# EAGLE design Adafruit MEMENTO Camera Board (EAGLE 9.6.2)

## Sheet 1 of 2
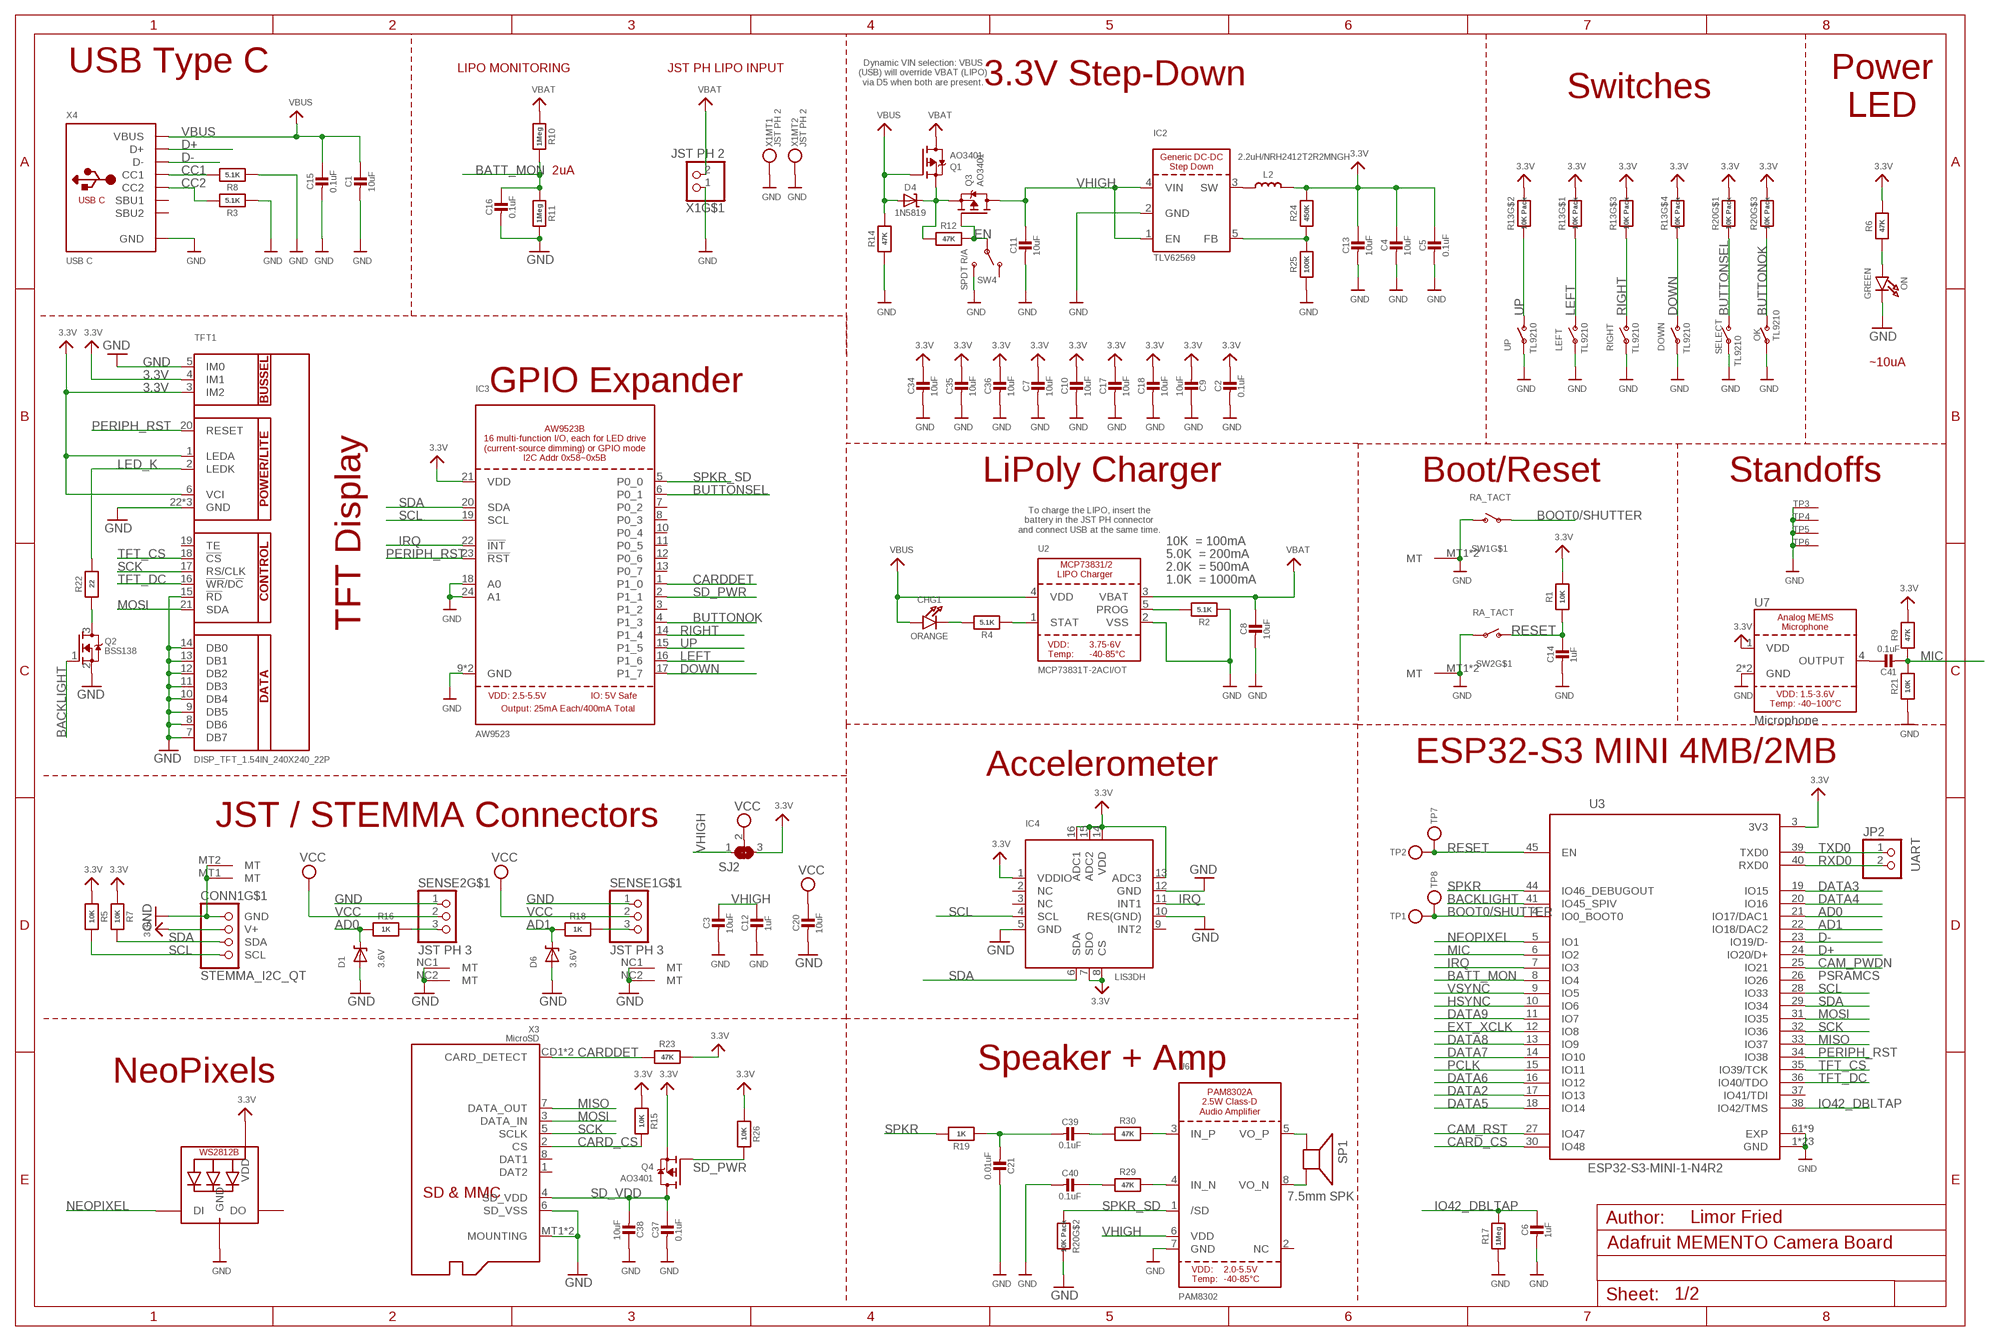
[diagram p0: schematic, sheet 1]

### Parts
C1  10uF  CAP_CERAMIC0805-NOOUTLINE  [0805-NO]
C2  0.1uF  CAP_CERAMIC0603_NO  [0603-NO]
C3  10uF  CAP_CERAMIC0805-NOOUTLINE  [0805-NO]
C4  10uF  CAP_CERAMIC0805-NOOUTLINE  [0805-NO]
C5  0.1uF  CAP_CERAMIC0603_NO  [0603-NO]
C6  1uF  CAP_CERAMIC0603_NO  [0603-NO]
C7  10uF  CAP_CERAMIC0805-NOOUTLINE  [0805-NO]
C8  10uF  CAP_CERAMIC0805-NOOUTLINE  [0805-NO]
C9  10uF  CAP_CERAMIC0805-NOOUTLINE  [0805-NO]
C10  10uF  CAP_CERAMIC0805-NOOUTLINE  [0805-NO]
C11  10uF  CAP_CERAMIC0805-NOOUTLINE  [0805-NO]
C12  1uF  CAP_CERAMIC0603_NO  [0603-NO]
C13  10uF  CAP_CERAMIC0805-NOOUTLINE  [0805-NO]
C14  1uF  CAP_CERAMIC0603_NO  [0603-NO]
C15  0.1uF  CAP_CERAMIC0603_NO  [0603-NO]
C16  0.1uF  CAP_CERAMIC0603_NO  [0603-NO]
C17  10uF  CAP_CERAMIC0805-NOOUTLINE  [0805-NO]
C18  10uF  CAP_CERAMIC0805-NOOUTLINE  [0805-NO]
C20  10uF  CAP_CERAMIC0805-NOOUTLINE  [0805-NO]
C21  0.01uF  CAP_CERAMIC0603_NO  [0603-NO]
C34  10uF  CAP_CERAMIC0805-NOOUTLINE  [0805-NO]
C35  10uF  CAP_CERAMIC0805-NOOUTLINE  [0805-NO]
C36  10uF  CAP_CERAMIC0805-NOOUTLINE  [0805-NO]
C37  0.1uF  CAP_CERAMIC0603_NO  [0603-NO]
C38  10uF  CAP_CERAMIC0805-NOOUTLINE  [0805-NO]
C39  0.1uF  CAP_CERAMIC0603_NO  [0603-NO]
C40  0.1uF  CAP_CERAMIC0603_NO  [0603-NO]
C41  0.1uF  CAP_CERAMIC0603_NO  [0603-NO]
CHG1  ORANGE  LED0603_NOOUTLINE  [CHIPLED_0603_NOOUTLINE]
CONN1  STEMMA_I2C_QT  [JST_SH4]
D1  3.6V  DIODE-ZENERSOD323  [SOD-323]
D4  1N5819  DIODE-SCHOTTKYSOD-123  [SOD-123]
D6  3.6V  DIODE-ZENERSOD323  [SOD-323]
DOWN  TL9210  SWITCH_SPST_NOMNT_TL9210  [TL9210]
IC2  TLV62569  VREG_BUCK_5PIN_AP3429/A  [SOT23-5]
IC3  AW9523  [QFN24_4MM_SMSC]
IC4  LIS3DH  ACCEL_LIS3DHTR  [LGA16_3X3MM]
JP2  UART  HEADER-1X2ROUND  [1X02_ROUND]
L2  2.2uH/NRH2412T2R2MNGH  INDUCTORNR3015  [INDUCTOR_TAIYOYUDEN_NR3015]
LED2  WS2812B_SK6805_1515  [SK6805_1515]
LEFT  TL9210  SWITCH_SPST_NOMNT_TL9210  [TL9210]
OK  TL9210  SWITCH_SPST_NOMNT_TL9210  [TL9210]
ON  GREEN  LED0603_NOOUTLINE  [CHIPLED_0603_NOOUTLINE]
Q1  AO3401  MOSFET-P  [SOT23-R]
Q2  BSS138  MOSFET-NWIDE  [SOT23-WIDE]
Q3  AO3401  MOSFET-P  [SOT23-R]
Q4  AO3401  MOSFET-P  [SOT23-R]
R1  10K  RESISTOR_0603_NOOUT  [0603-NO]
R2  5.1K  RESISTOR_0603_NOOUT  [0603-NO]
R3  5.1K  RESISTOR_0603_NOOUT  [0603-NO]
R4  5.1K  RESISTOR_0603_NOOUT  [0603-NO]
R5  10K  RESISTOR_0603_NOOUT  [0603-NO]
R6  47K  RESISTOR_0603_NOOUT  [0603-NO]
R7  10K  RESISTOR_0603_NOOUT  [0603-NO]
R8  5.1K  RESISTOR_0603_NOOUT  [0603-NO]
R9  47K  RESISTOR_0603_NOOUT  [0603-NO]
R10  1Meg  RESISTOR_0603_NOOUT  [0603-NO]
R11  1Meg  RESISTOR_0603_NOOUT  [0603-NO]
R12  47K  RESISTOR_0603_NOOUT  [0603-NO]
R13  10K Pack  RESISTOR_4PACK  [RESPACK_4X0603]
R14  47K  RESISTOR_0603_NOOUT  [0603-NO]
R15  10K  RESISTOR_0603_NOOUT  [0603-NO]
R16  1K  RESISTOR_0603_NOOUT  [0603-NO]
R17  1Meg  RESISTOR_0603_NOOUT  [0603-NO]
R18  1K  RESISTOR_0603_NOOUT  [0603-NO]
R19  1K  RESISTOR_0603_NOOUT  [0603-NO]
R20  10K Pack  RESISTOR_4PACK  [RESPACK_4X0603]
R21  10K  RESISTOR_0603_NOOUT  [0603-NO]
R22  22  RESISTOR_0603_NOOUT  [0603-NO]
R23  47K  RESISTOR_0603_NOOUT  [0603-NO]
R24  450K  RESISTOR_0603_NOOUT  [0603-NO]
R25  100K  RESISTOR_0603_NOOUT  [0603-NO]
R26  10K  RESISTOR_0603_NOOUT  [0603-NO]
R29  47K  RESISTOR_0603_NOOUT  [0603-NO]
R30  47K  RESISTOR_0603_NOOUT  [0603-NO]
RIGHT  TL9210  SWITCH_SPST_NOMNT_TL9210  [TL9210]
SELECT  TL9210  SWITCH_SPST_NOMNT_TL9210  [TL9210]
SENSE1  JST PH 3  CON_JST_PH_3PIN  [JSTPH3]
SENSE2  JST PH 3  CON_JST_PH_3PIN  [JSTPH3]
SJ2  SOLDERJUMPER_2WAY  [SOLDERJUMPER_2WAY_OPEN_NOPASTE]
SP1  7.5mm SPK  SPEAKER_7.5MM  [BUZZER_SMT_7.5MM]
SW1  RA_TACT  SWITCH_SPST_MNT_TACT_RA  [SPST_TACTILE_RA]
SW2  RA_TACT  SWITCH_SPST_MNT_TACT_RA  [SPST_TACTILE_RA]
SW4  SPDT R/A  SWITCH_SPDT  [SPDT_SMT_SSSS811101]
TFT1  DISP_TFT_1.54IN_240X240_22P  [TFT_1.54IN_240X240_22PIN]
TP1  TESTPOINTROUND1.5MMNO  [TESTPOINT_ROUND_1.5MM_NO]
TP2  TESTPOINTROUND1.5MMNO  [TESTPOINT_ROUND_1.5MM_NO]
TP3  SEWTAP_SMTNUTM3  [SMT_NUT_3MM]
TP4  SEWTAP_SMTNUTM3  [SMT_NUT_3MM]
TP5  SEWTAP_SMTNUTM3  [SMT_NUT_3MM]
TP6  SEWTAP_SMTNUTM3  [SMT_NUT_3MM]
TP7  TESTPOINTROUND1.5MMNO  [TESTPOINT_ROUND_1.5MM_NO]
TP8  TESTPOINTROUND1.5MMNO  [TESTPOINT_ROUND_1.5MM_NO]
U2  MCP73831T-2ACI/OT  MCP73831/2  [SOT23-5]
U3  ESP32-S3-MINI-1-N4R2  ESP32-S3-MINI-1  [ESP32-S2-MINI-1]
U6  PAM8302  AUDIOAMP_PAM8302A  [MSOP8_0.65MM]
U7  Microphone  ANALOG_MEMS_MIC_2.75X1.85  [MEMS_MIC_2.75X1.85]
UP  TL9210  SWITCH_SPST_NOMNT_TL9210  [TL9210]
X1  JST PH 2  CON_JST_PH_2PIN_MT_BATT  [JSTPH2_BATT]
X3  MicroSD  MICROSD  [MICROSD]
X4  USB C  USB_C  [USB_C_CUSB31-CFM2AX-01-X]

### Nets
3.3V [power]: C2.1 C4.1 C5.1 C7.1 C9.2 C10.1 C13.1 C17.1 C18.1 C34.1 C35.1 C36.1 CONN1.2(V+) IC3.21(VDD) IC4.1(VDDIO) IC4.7(SDO) IC4.8(CS) IC4.13(ADC3) IC4.14(VDD) IC4.15(ADC2) IC4.16(ADC1) L2.P$2 LED2.2(VDD) Q4.2(S) R1.2 R5.1 R6.2 R7.1 R9.2 R13.5 R13.6 R13.7 R13.8 R15.2 R20.6 R20.8 R23.2 R24.2 R26.1 SJ2.3 TFT1.1(LEDA) TFT1.3(IM2) TFT1.4(IM1) TFT1.6(VCI) U3.3(3V3) U7.1(VDD) ; also sheet 2
A1_JST1: R18.1 SENSE1.3
AD0: D1.C R16.2 U3.21(IO17/DAC1)
AD1: D6.C R18.2 U3.22(IO18/DAC2)
BACKLIGHT: Q2.1(G) U3.41(IO45_SPIV)
BATT_MON: C16.1 R10.2 R11.1 U3.8(IO4)
BOOT0/SHUTTER: SW1.1(P) TP1.P$1 TP8.P$1 U3.4(IO0_BOOT0)
BUTTONOK: IC3.4(P1_3) OK.2(S) R20.3
BUTTONSEL: IC3.6(P0_1) R20.1 SELECT.2(S)
CAM_PWDN: U3.25(IO21) ; also sheet 2
CAM_RST: U3.27(IO47) ; also sheet 2
CARD_CS: R15.1 U3.30(IO48) X3.2(CS)
CARDDET: IC3.1(P1_0) R23.1 X3.CD1(CARD_DETECT) X3.CD2(CARD_DETECT)
CC1: R8.2 X4.A5(CC1)
CC2: R3.2 X4.B5(CC2)
D10_JST: R16.1 SENSE2.3
D+: U3.24(IO20/D+) X4.A6(D+) X4.B6(D+)
D-: U3.23(IO19/D-) X4.A7(D-) X4.B7(D-)
DATA2: U3.17(IO13) ; also sheet 2
DATA3: U3.19(IO15) ; also sheet 2
DATA4: U3.20(IO16) ; also sheet 2
DATA5: U3.18(IO14) ; also sheet 2
DATA6: U3.16(IO12) ; also sheet 2
DATA7: U3.14(IO10) ; also sheet 2
DATA8: U3.13(IO9) ; also sheet 2
DATA9: U3.11(IO7) ; also sheet 2
DOWN: DOWN.2(S) IC3.17(P1_7) R13.4
EN: Q3.1(G) R12.2 SW4.B(P)
EXT_XCLK: U3.12(IO8) ; also sheet 2
FB: IC2.5(FB) R24.1 R25.2
GND [lowpower]: C1.2 C2.2 C3.2 C4.2 C5.2 C6.2 C7.2 C8.2 C9.1 C10.2 C11.2 C12.2 C13.2 C14.2 C15.2 C16.2 C17.2 C18.2 C20.2 C21.1 C34.2 C35.2 C36.2 C37.2 C38.1 C40.2 CONN1.1(GND) CONN1.MT1(MT) CONN1.MT2(MT) D1.A D6.A DOWN.1(P) IC2.2(GND) IC3.9(GND) IC3.18(A0) IC3.24(A1) IC3.THERM(GND) IC4.5(GND) IC4.10(RES(GND)) IC4.12(GND) LED2.4(GND) LEFT.1(P) OK.1(P) ON.C Q2.2(S) R2.1 R3.1 R8.1 R11.2 R14.1 R17.1 R20.7 R21.1 R25.1 RIGHT.1(P) SELECT.1(P) SENSE1.1 SENSE1.NC1(MT) SENSE1.NC2(MT) SENSE2.1 SENSE2.NC1(MT) SENSE2.NC2(MT) SW1.2(S) SW1.MT1(MT) SW1.MT2(MT) SW2.1(P) SW2.MT1(MT) SW2.MT2(MT) SW4.C(S) TFT1.5(IM0) TFT1.7(DB7) TFT1.8(DB6) TFT1.9(DB5) TFT1.10(DB4) TFT1.11(DB3) TFT1.12(DB2) TFT1.13(DB1) TFT1.14(DB0) TFT1.15(!RD) TFT1.22(GND) TFT1.SUPPORT1(GND) TFT1.SUPPORT2(GND) TP3.P$1(SEW) TP4.P$1(SEW) TP5.P$1(SEW) TP6.P$1(SEW) U2.2(VSS) U3.1(GND) U3.2(GND) U3.42(GND) U3.43(GND) U3.46(GND) U3.47(GND) U3.48(GND) U3.49(GND) U3.50(GND) U3.51(GND) U3.52(GND) U3.53(GND) U3.54(GND) U3.55(GND) U3.56(GND) U3.57(GND) U3.58(GND) U3.59(GND) U3.60(GND) U3.61(EXP) U3.62(GND) U3.63(GND) U3.64(GND) U3.65(GND) U3.66(EXP) U3.67(EXP) U3.68(EXP) U3.69(EXP) U3.70(EXP) U3.71(EXP) U3.72(EXP) U3.73(EXP) U6.7(GND) U7.2(GND) U7.3(GND) UP.1(P) X1.1 X1.NC1 X1.NC2 X3.6(SD_VSS) X3.MT1(MOUNTING) X3.MT2(MOUNTING) X4.A1B12(GND) X4.B1A12(GND) ; also sheet 2
HSYNC: U3.10(IO6) ; also sheet 2
IO42_DBLTAP: C6.1 R17.2 U3.38(IO42/TMS)
IRQ: IC3.22(!INT) IC4.11(INT1) U3.7(IO3)
LED_K: R22.1 TFT1.2(LEDK)
LEFT: IC3.16(P1_6) LEFT.2(S) R13.1
MIC: C41.2 R9.1 R21.2 U3.6(IO2)
MISO: U3.33(IO37) X3.7(DATA_OUT)
MOSI: TFT1.21(SDA) U3.31(IO35) X3.3(DATA_IN)
N$1: C41.1 U7.4(OUTPUT)
N$3: ON.A R6.1
N$4: R4.1 U2.1(STAT)
N$5: Q2.3(D) R22.2
N$6: CHG1.C R4.2
N$7: R29.2 U6.4(IN_N)
N$8: R30.2 U6.3(IN_P)
N$9: R2.2 U2.5(PROG)
N$10: C40.1 R29.1
N$11: SP1.- U6.8(VO_N)
N$12: SP1.+ U6.5(VO_P)
N$13: C39.1 R30.1
N$14: C21.2 C39.2 R19.1
N$15: IC2.3(SW) L2.P$1
N$21: D4.C Q1.2(S) Q3.2(S) R12.1
NEOPIXEL: LED2.1(DI) U3.5(IO1)
PCLK: U3.15(IO11) ; also sheet 2
PERIPH_RST: IC3.23(!RST) TFT1.20(RESET) U3.34(IO38)
RESET: C14.1 R1.1 SW2.2(S) TP2.P$1 TP7.P$1 U3.45(EN)
RIGHT: IC3.14(P1_4) R13.3 RIGHT.2(S)
RXD0: JP2.2 U3.40(RXD0)
SCK: TFT1.17(RS/CLK) U3.32(IO36) X3.5(SCLK)
SCL: CONN1.4(SCL) IC3.19(SCL) IC4.4(SCL) R5.2 U3.28(IO33) ; also sheet 2
SD_PWR: IC3.2(P1_1) Q4.1(G) R26.2
SD_VDD [power]: C37.1 C38.2 Q4.3(D) X3.4(SD_VDD)
SDA: CONN1.3(SDA) IC3.20(SDA) IC4.6(SDA) R7.2 U3.29(IO34) ; also sheet 2
SPKR: R19.2 U3.44(IO46_DEBUGOUT)
SPKR_SD: IC3.5(P0_0) R20.2 U6.1(/SD)
TFT_CS: TFT1.18(!CS) U3.35(IO39/TCK)
TFT_DC: TFT1.16(!WR!/D!C) U3.36(IO40/TDO)
TXD0: JP2.1 U3.39(TXD0)
UP: IC3.15(P1_5) R13.2 UP.2(S)
VBAT [power]: C8.1 Q1.3(D) R10.1 U2.3(VBAT) X1.2
VBUS [power]: C1.1 C15.1 CHG1.A D4.A Q1.1(G) R14.2 U2.4(VDD) X4.A4B9(VBUS) X4.B4A9(VBUS)
VCC [power]: C20.1 SENSE1.2 SENSE2.2 SJ2.2
VHIGH [power]: C3.1 C11.1 C12.1 IC2.1(EN) IC2.4(VIN) Q3.3(D) SJ2.1 U6.6(VDD) ; also sheet 2
VSYNC: U3.9(IO5) ; also sheet 2
Unconnected: IC3.3(P1_2) IC3.7(P0_2) IC3.8(P0_3) IC3.10(P0_4) IC3.11(P0_5) IC3.12(P0_6) IC3.13(P0_7) IC4.2(NC) IC4.3(NC) IC4.9(INT2) LED2.3(DO) R20.4 R20.5 SW4.A(O) TFT1.19(TE) U3.26(IO26) U3.37(IO41/TDI) U6.2(NC) X3.1(DAT2) X3.8(DAT1) X4.A8(SBU1) X4.B8(SBU2)

### Notes on the sheet
- USB Type C
- LIPO MONITORING | JST PH LIPO INPUT
- Dynamic VIN selection: VBUS
  (USB) will override VBAT (LIPO)
  via D5 when both are present.
- 3.3V Step-Down
- Switches
- Power
  LED
- 2uA
- ~10uA
- GPIO Expander
- LiPoly Charger | Boot/Reset | Standoffs
- To charge the LIPO, insert the
  battery in the JST PH connector
  and connect USB at the same time.
- TFT Display
- 10K  = 100mA
- 5.0K  = 200mA
- 2.0K  = 500mA
- 1.0K  = 1000mA
- ESP32-S3 MINI 4MB/2MB
- Accelerometer
- JST / STEMMA Connectors
- PSRAMCS
- Speaker + Amp
- NeoPixels
- Limor Fried

## Sheet 2 of 2
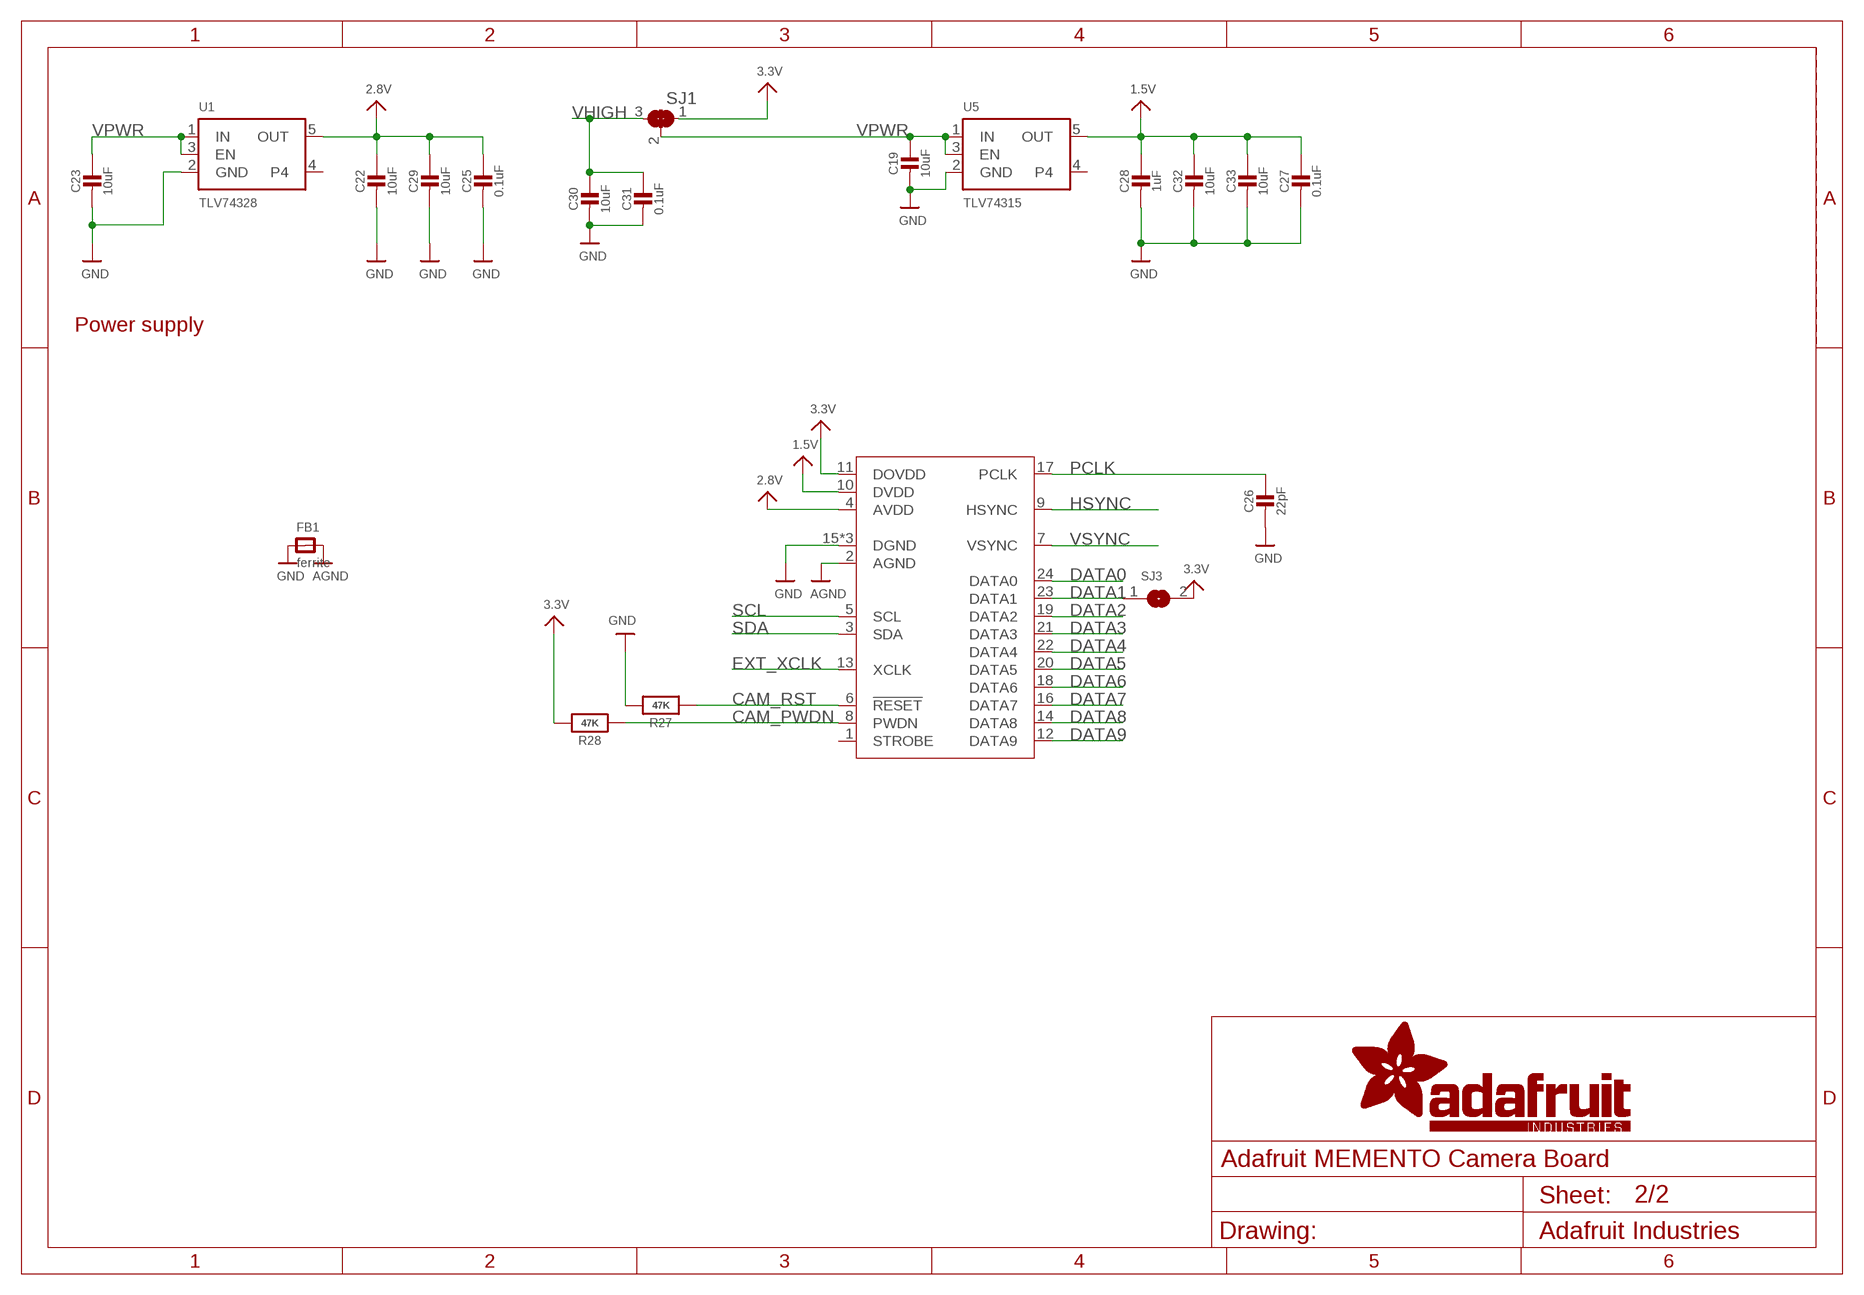
[diagram p1: schematic, sheet 2]

### Parts
C19  10uF  CAP_CERAMIC0805-NOOUTLINE  [0805-NO]
C22  10uF  CAP_CERAMIC0805-NOOUTLINE  [0805-NO]
C23  10uF  CAP_CERAMIC0805-NOOUTLINE  [0805-NO]
C25  0.1uF  CAP_CERAMIC0603_NO  [0603-NO]
C26  22pF  CAP_CERAMIC0603_NO  [0603-NO]
C27  0.1uF  CAP_CERAMIC0603_NO  [0603-NO]
C28  1uF  CAP_CERAMIC0603_NO  [0603-NO]
C29  10uF  CAP_CERAMIC0805-NOOUTLINE  [0805-NO]
C30  10uF  CAP_CERAMIC0805-NOOUTLINE  [0805-NO]
C31  0.1uF  CAP_CERAMIC0603_NO  [0603-NO]
C32  10uF  CAP_CERAMIC0805-NOOUTLINE  [0805-NO]
C33  10uF  CAP_CERAMIC0805-NOOUTLINE  [0805-NO]
FB1  ferrite  FERRITE-0603NO  [0603-NO]
R27  47K  RESISTOR_0603_NOOUT  [0603-NO]
R28  47K  RESISTOR_0603_NOOUT  [0603-NO]
SJ1  SOLDERJUMPER_2WAY  [SOLDERJUMPER_2WAY_OPEN_NOPASTE]
SJ3  SOLDERJUMPERCLOSED  [SOLDERJUMPER_CLOSEDWIRE]
U1  TLV74328  VREG_SOT23-5  [SOT23-5]
U5  TLV74315  VREG_SOT23-5  [SOT23-5]
X2  CAMERA_OV2640  [OV2640FSL]

### Nets
1.5V: C27.1 C28.1 C32.1 C33.1 U5.5(OUT) X2.10(DVDD)
2.8V [power]: C22.1 C25.1 C29.1 U1.5(OUT) X2.4(AVDD)
3.3V [power]: R28.2 SJ1.1 SJ3.2 X2.11(DOVDD) ; also sheet 1
AGND: FB1.2 X2.2(AGND)
CAM_PWDN: R28.1 X2.8(PWDN) ; also sheet 1
CAM_RST: R27.1 X2.6(!RESET) ; also sheet 1
DATA0: X2.24(DATA0)
DATA1: SJ3.1 X2.23(DATA1)
DATA2: X2.19(DATA2) ; also sheet 1
DATA3: X2.21(DATA3) ; also sheet 1
DATA4: X2.22(DATA4) ; also sheet 1
DATA5: X2.20(DATA5) ; also sheet 1
DATA6: X2.18(DATA6) ; also sheet 1
DATA7: X2.16(DATA7) ; also sheet 1
DATA8: X2.14(DATA8) ; also sheet 1
DATA9: X2.12(DATA9) ; also sheet 1
EXT_XCLK: X2.13(XCLK) ; also sheet 1
GND [lowpower]: C19.2 C22.2 C23.2 C25.2 C26.2 C27.2 C28.2 C29.2 C30.2 C31.2 C32.2 C33.2 FB1.1 R27.2 U1.2(GND) U5.2(GND) X2.15(DGND) X2.SPRT1(DGND) X2.SPRT2(DGND) ; also sheet 1
HSYNC: X2.9(HSYNC) ; also sheet 1
PCLK: C26.1 X2.17(PCLK) ; also sheet 1
SCL: X2.5(SCL) ; also sheet 1
SDA: X2.3(SDA) ; also sheet 1
VHIGH [power]: C30.1 C31.1 SJ1.3 ; also sheet 1
VPWR [power]: C19.1 C23.1 SJ1.2 U1.1(IN) U1.3(EN) U5.1(IN) U5.3(EN)
VSYNC: X2.7(VSYNC) ; also sheet 1
Unconnected: U1.4 U5.4 X2.1(STROBE)

### Notes on the sheet
- Power supply

## Library data of the parts
C1-C23 C25-C41 = microbuilder:CAP_CERAMIC: Ceramic Capacitors For new designs, use the packages preceded by an '_' character since they are more reliable: The following footprints should be used on most boards: _0402 - Standard footprint for regular board layouts _0603 - Standard footprint for regular board layouts _0805 - Standard footprint for regular board layouts _1206 - Standard footprint for regular board layouts For extremely tight-pitch boards where space is at a premium, the following 'micro-pitch' footprints can be used (smaller pads, no silkscreen outline, etc.): _0402MP - Micro-pitch footprint for very dense/compact boards _0603MP - Micro-pitch footprint for very dense/compact boards _0805MP - Micro-pitch footprint for very dense/compact boards _1206MP - Micro-pitch footprint for very dense/compact boards
CHG1 ON = microbuilder:LED: LED 0603 - 0603 Surface Mount Package 2mA: Green LED - Low Power (3.9mcd, 2ma, 1.7Vf) - Digikey: 475-2709-2-ND Orange LED - Low Power (9.8mcd, 2ma, 1.8Vf) - Digikey: 475-1194-2-ND Red LED - Low Power (5mcd, 2ma, 1.8Vf) - Digikey: 475-1195-2-ND Yellow LED - Low Power (7mcd, 2ma, 1.8Vf) - Digikey: 475-1196-2-ND 5mA: Blue LED - Low Power (17mcd, 5ma, 2.9Vf) - Digikey: LNJ937W8CRACT-ND 0805 - 0805 Surface Mount Package 2mA: Red LED (8.8mcd, 2mA, 1.8Vf, Clear) - Low Power [Digikey: 475-2510-1-ND] Green LED (5mcd, 2mA, 1.8Vf, Clear) - Low Power [Digikey: 475-2730-1-ND] Yellow LED (11.3mcd, 2mA, 1.8Vf, Clear) - Low Power [Digikey: 475-2555-1-ND] 20mA: Red LED (104mcd, 20mA, Diffused) - LS R976 [Digikey: 475-1278-6-ND] Red LED (12mcd, 20mA, 2.0Vf, Clear) - APT2012EC [Digikey: 754-1128-1-ND] Green LED (15mcd, 20mA, 2.2Vf, Clear) - APT2012GC [Digikey: 754-1131-1-ND] Orange LED (160mcd, 20mA, 2.1Vf, Clear) - APT2012SECK [Digikey: 754-1130-1-ND] 1206 - 1206 Surface Mount Package Green LED (26mcd, 20mA, Diffused) - LG N971 [Digikey: 475-1407-6-ND] Red LED (15mcd, 20mA, Diffused) - LH N974 [Digikey: 475-1416-6-ND] Cree - Cree High-Power Surface Mount LEDs XPEBWT-L1-0000-00D50 - White 111lm 350mA 2.9Vf 6200K 110° XTEAWT-00-0000-00000LEE3 - White 114lm 350mA 2.85Vf 5000K 115° Everlight - Everlight 45-21 Series Surface Mount LEDs 45-21/QK2C-B2832AC2CB2/2T - Warm White 2000mcd 20mA 3.25Vf 3050K 120° 45-21/LK2C-B38452C4CB2/2T - Nuetral White 2000mcd 20mA 3.25Vf 4150K 120° 45-21/LK2C-B50634C6CB2/2T - Cold White 2200mcd 20mA 3.25Vf 5650K 120° PLCC2 Reverse Mount LS T77K-J1L2-1-0-2-R18-Z - Red 11.25mcd 2mA 1.8Vf 630nm 120° LO T77K-L1M2-24-Z - Orange 19.6mcd 2mA 1.8Vf 606nm 120° LY T77K-K2M1-26-Z - Yellow 15.7mcd 2mA 1.8Vf 587nm 120°; ROT: 270
CONN1 = adafruit_electromech:STEMMA_I2C; LCSC: C2845363
D1 D6 = microbuilder:DIODE-ZENER: Zener Diode SMA: 30V 1W Zener Diode, 1.2Vf - Digikey: SMAZ30-FDICT-ND
D4 = microbuilder:DIODE-SCHOTTKY
DOWN LEFT OK RIGHT SELECT UP = adafruit_electromech:SWITCH_SPST_NOMNT
FB1 = microbuilder:FERRITE: Ferrite Bead 0603 MMZ1608B121C - 120 Ohm @ 100MHz, 600mA, 0.15 Ohm DC Resistance - Digikey: 445-2164-1-ND BK1608HW121-T - 120 Ohm, 600mA Ferrite Chip - Digikey: 587-1876-2-ND 0805 HZ0805B272R-10 - 2.7K Ohm @ 100MHz, 200mA, 0.8 Ohm DC Resistance - Digikey: 240-2504-1-ND (see also Murata BLM21BD272SN1L) MMZ2012Y152B - 1.5K Ohm @ 100MHz, 500mA, 0.4 Ohm DC Resistance - Digikey: 445-1560-1-ND - Mainly for high frequency (80-400MHz) MMZ2012R102A - 1K Ohm @ 100MHz, 500mA, 0.3 Ohm DC Resistance - Digikey: 445-1555-2-ND - More general purpose (10-200MHz)
IC2 = adafruit_power:VREG_BUCK_5PIN
IC3 = microbuilder:AW9523
IC4 = adafruit_sensor:ACCEL_LIS3DHTR: LIS3DHTR 3-Axis Accelerometer with I2C/SPI Interface VDD: 1.71-3.6V VDDIO: 1.71-VDD+0.1V Scale: +/-2g, 4g, 8g, 16g with 16--bit data output Temp:: -40°C - 85°C Mouser: 511-LIS3DHTR Digikey: 497-10613-1-ND
JP2 = microbuilder:HEADER-1X2: PIN HEADER
L2 = microbuilder:INDUCTOR: Inductors 0603: 10nH Ceramic Inductor - microwire antenna/RF (Digikey: 712-1434-2-ND) 0805: 560nH Ceramic Inductor - RF (Digikey: 553-1047-1-ND) 270nH Ceramic Inductor - Q = 40@250MHz, +-5%, 1 Ohm DC Resistance (Digikey: 535-10506-2-ND) 1007 (2518 Metric) SMT: 10µH 10% 250mOhm 820mA 1007 Inductor (Digikey: 587-2189-1-ND) 22µH 10% 500mOhm 580mA 1007 Inductor (Digikey: 587-2190-1-ND) 47µH 10% 950mOhm 420mA 1007 Inductor (Digikey: 587-2191-1-ND) 47µH 5% 100mOhm 1A 1008 Inductor (Digikey: 732-1816-1-ND) 5.0x5.0mm (Taiyo Yuden NR5040 Series) 6.8µH 20% 2.3A 64mOhm Inductor (Digikey: 587-2374-2-ND) 5.0x5.0mm (TDK VLC5045 Series) 4.7µH 20% 3.3A 34mOhm Inductor (Digikey: 445-6526-1-ND) 6.8µH 20% 2.7A 46mOhm Inductor (Digikey: 445-6527-1-ND) 6.0x6.0mm (TDK VLC6045 Series) 4.7µH 20% 3.8A 27mOhm Inductor (Digikey: 445-6538-2-ND) 6.8µH 20% 3A 41mOhm Inductor (Digikey: 445-6540-1-ND) 6.2µH 30% 2.2A 45mOhm Inductor (Digikey: SRR5028-6R2YCT-ND) - Not TDK VLC6045 but footprint should match 6.0x6.0mm (TDK SLF6045 Series) 6.8uH 30% 2A 33mOhm Inductor (Digikey: 445-4572-1-ND, Mouser: 810-SLF645T6R8N2R0PF) 6.0x6.0mm (Sumida CDRH5D28 Series) 6.2uH 30% 1.8A 45mOhm Inductor (Digikey: 308-1542-1-ND) Taiyo Yuden NR3015T2R2M - 2.2uH 20% 1.5A (Digikey: 587-1648-2-ND, Mouser: 963-NR3015T2R2M) - Used with TI TPS62172 CoilCraft RFID Transponder Coil - MA5532-AE (For use with AS3935 Lightning Sensor) Taiyo Yuden NRH2412T2R2MNGH - 2.2uH 20% 1AA (Digikey: 587-3443-1-ND) - Used with TI LM3671 Vishay IHLP 1.0uH Molded Inductor - 24mOhm DCR, 5A, +/-20%, -55°C-125°C (Digikey: 541-1319-1-ND)
LED2 = microbuilder:WS2812B; LCSC: C2890035
Q1 Q3 Q4 = microbuilder:MOSFET-P: P-Channel Mosfet LEGEND VDS: Voltage Drain-Source ID: Drain Current RDS(ON): Drain-Source On-State Resistance VGS(TH): Gate-Source Threshold Voltage CISS: Drain-Source Input Capacitance SOT-23 Name VDS ID RDS(ON) VGS(TH) CISS Order Number IRLML5103 30V 760mA 600 mOhm -- 75pF @ 25V Digikey: IRLML5103PBFCT-ND IRLML6401 12V 4.3A 50 mOhm 950mV @ 250µA 830pF @ 10V Digikey: IRLML6401PBFTR-ND NTR0202PL 20V 400mA 800 mOhm 2.3V @ 250uA 70pF @ 5V Digikey: NTR0202PLT1GOSTR-ND NTR4101PT1G 20V 1.8A 85 mOhm 1.2V @ 250uA 675pF @ 10V Digikey: NTR4101PT1GOSCT-ND DMP2004K 20V 600mA 900 mOhm 1V @ 250uA 175pF @ 16V Digikey: DMP2004KDICT-ND PMV65XP 20V 3.9A 76 mOhm 950mV @ 1mA 725pF @ 20V Digikey: 568-2358-2-ND TO-252 Name VDS ID RDS(ON) VGS(TH) CISS Order Number AOD417 30V 25A 34 mOhm 3V @ 250µA 920pF @ 15V Digikey: 785-1106-2-ND PowerPak Name VDS ID RDS(ON) VGS(TH) CISS Order Number AON7401 30V 12A 14 mOhm 3V @ 250µA 2600pF @ 15V Digikey: 785-1302-1-ND
Q2 = microbuilder:MOSFET-N: N-Channel Mosfet LEGEND VDS: Voltage Drain-Source ID: Drain Current RDS(ON): Drain-Source On-State Resistance VGS(TH): Gate-Source Threshold Voltage CISS: Drain-Source Input Capacitance SOT-23 Name VDS ID RDS(ON) VGS(TH) CISS Order Number 2N7002E 60V 260mA 2.5 Ohm 2.5V @ 250uA 26.7pF @ 25V 2N7002ET1GOSTR-ND BSH103 30V 850mA 400 mOhm 400mV @ 1mA 83pF @ 24V BSH103,235-ND BSS138 60V 320mA 1.6 Ohm 1.5V @ 250uA 50pF @ 10V Mouser: 771-BSS138PW115 DMN2075U-7 20V 4.2A 38 mOhm 1V @ 250 uA 594.3pF @ 10V DMN2075U-7DICT-ND * BSS138 good choice for I2C level-shifting POWERPAK 1212-8 Name VDS ID RDS(ON) VGS(TH) CISS Order Number Si7308DN 60V 6A 58 mOhm 3V @ 250uA 665pF @ 15V SI7308DN-T1-E3CT-ND
R1-R12 R14-R19 R21-R30 = microbuilder:RESISTOR: Resistors For new designs, use the packages preceded by an '_' character since they are more reliable: The following footprints should be used on most boards: _0402 - Standard footprint for regular board layouts _0603 - Standard footprint for regular board layouts _0805 - Standard footprint for regular board layouts _1206 - Standard footprint for regular board layouts For extremely tight-pitch boards where space is at a premium, the following 'micro-pitch' footprints can be used (smaller pads, no silkscreen outline, etc.): _0402MP - Micro-pitch footprint for very dense/compact boards _0603MP - Micro-pitch footprint for very dense/compact boards _0805MP - Micro-pitch footprint for very dense/compact boards _1206MP - Micro-pitch footprint for very dense/compact boards
R13 R20 = microbuilder:RESISTOR_4PACK: Resistor Packs (4 resistors) 4 x 0603 10K 1/16W - Digikey: YC164J-10KCT-ND
SENSE1 SENSE2 = adafruit_electromech:CON_JST_PH_3PIN
SJ1 SJ2 = microbuilder:SOLDERJUMPER_2WAY: 2-Way Solder Jumper
SJ3 = microbuilder:SOLDERJUMPER: SMD Solder JUMPER Solder the two pads together to create a connection, or remove the solder to break it. REFLOW - Use this footprint for solder paste and reflow ovens. WAVE - Use this footprint for hand-soldering (larger pads). CLOSED - Has a trace between the two pads to ensure it is closed by default. The trace needs to be cut to disable the jumper, and can be closed again by creating a solder bridge between the two pads.
SP1 = microbuilder:SPEAKER: SPEAKER Source: Buerklin Added PS12 (for part # PS1240 piezo) http://www.ladyada.net/library/pcb/eaglelibrary.html; ROT: 180
SW1 SW2 = adafruit_electromech:SWITCH_SPST_MNT: Switch - SPST 4UCon 19192 (6.7x2.6mm SMT); LCSC: C778159
SW4 = adafruit_electromech:SWITCH_SPDT: Switch - SPDT SSSS811101 - Horizontal Two Position SMT, 0.3A 4V [Mouser: 688-SSSS811101]
TFT1 = adafruit_display:DISP_TFT_1.54IN_240X240_22P
TP1 TP2 TP7 TP8 = microbuilder:TESTPOINT: Test Point Various test points for characterisation and PCB testing TESTPOINT_SMT - Compact Surface Mount Test Point [Digikey: 5016KTR-ND]
TP3-TP6 = adafruit_electromech:SEWTAP; FORCETHM: 1
U1 U5 = adafruit_power:VREG_SOT23-5: SOT23-5 Fixed Voltage Regulators Part Current Out V Out V In V Dropout θJA (°C/W) TJ (°C) Digikey Part No. ADP121 150mA 3.3V 3.4-5.5V 0.09V @ 150mA -- -- ADP121-AUJZ33R7CT-ND ADP121 150mA 3.0V 3.1-5.5V 0.09V @ 150mA -- -- ADP121-AUJZ30R7CT-ND ADP122 300mA 3.3V 3.4-5.5V 0.085V @ 300mA -- -- ADP122AUJZ-3.3-R7CT-ND ADP1712 300mA 3.3V 3.5-5.5V 0.17V @ 300mA -- -- ADP1712AUJZ-3.3-R7TR-ND AP7311 (Low Cost) 150mA 3.3V 3.5-6V 0.15V @ 150mA -- -- AP7311-33WG-7DICT-ND LD39015M18R 150mA 1.8V 1.9V-5.5V 0.08V @ 100mA -- -- 497-6977-1-ND LP2985A-33DBVR 150mA 3.3V 3.3-16V 0.28V @ 150mA 206 150 296-18479-1-ND MCP1824T-3302E/OT 300mA 3.3V 3.5V-6V 0.2V @ 300mA -- -- MCP1824T-3302E/OTCT-ND MIC5205-2.5YM5 TR 150mA 2.5V 2.7-16V 0.165V @ 150mA -- -- 576-1257-2-ND MIC5205-3.0YM5 TR 150mA 3.0V 3.2V-16V 0.165V @ 150mA -- -- 576-1258-2-ND MIC5205-3.3YM5 TR 150mA 3.3V 3.5V-16V 0.165V @ 150mA -- -- 576-1259-2-ND TPS780330220 150mA 3.3V+2.2V 3.6-5.5V 250mV Max -- -- 296-23332-1-ND TDA3663/N1,135 100mA 3.3V 3.5-45V 0.18V @ 50mA -- -- 568-5343-1-ND Max operating temp can be calculated using θJA, TJ (max junction temperature), and power in watts. Set the "Maximum Ambient Temperature" until it reaches TJ ("Max Junction Temperature"), which is the absolute limit for safe use of the regulator: Heat Sink Temperature Calculator <http://www.daycounter.com/Calculators/Heat-Sink-Temperature-Calculator.phtml> For example, With 12V source into a 3.3V LP2985 and a 30mA load, we are dissipating (12V-3.3V) * 0.03A = 0.261W. With a θJA of 206 °C/W, a TJ of 150°C, and 261mW we can safely use the chip without a heat sink up to 75°C (=147.1°C Junction Temperature).; JLC_ROTATION: 0
U2 = microbuilder:MCP73831/2: MCP73831/2 LIPO Charger VDD: 3.75 - 6V Temp -40 - 85°C Programmable Charge Rate: 15-500mA NOTE: STAT is a tri-state logic output on the MCP73831 and an open-drain output on the MCP73832. SOT23-5 with 4.2V output and tri-state logic on STAT = MCP73831T-2ACI/OT; JLC_ROTATION: 0; LCSC: C424093
U3 = adafruit_wireless:ESP32-S3-MINI-1; BUILT_BY: EMA_Kyle; COPYRIGHT: Copyright (C) 2018 Accelerated Designs. All rights reserved; DATASHEET: https://www.espressif.com/sites/default/files/documentation/esp32-s2-mini-1_esp32-s2-mini-1u_datasheet_en.pdf; MANUFACTURER_PART_NUMBER: ESP32-S2-MINI-1; SOURCELIBRARY: Add_to_database_2020-11-03; VENDOR: Espressif Systems
U6 = microbuilder:AUDIOAMP_PAM8302A: PAM8302A - 2.5W Class-D Mono Audio Amplifier MSOP8 = PAM8302AASCR
U7 = adafruit_sensor:ANALOG_MEMS_MIC: SPW2430HR5H-B - Silicon Microphone
X1 = adafruit_electromech:CON_JST_PH_2PIN_MT; LCSC: C47647
X2 = adafruit_sensor:CAMERA_OV2640
X3 = adafruit_electromech:MICROSD: MicroSD/Transflash Card Holder with SPI pinout 3M: 2908-05WB-MG 4UConnector: 19656 Footprint courtesy: Adafruit Industries; JLC_ROTATION: 90; LCSC: C125617
X4 = adafruit_electromech:USB_C: USB Type-C USB 2.0 Connector; LCSC: C165948

## Net classes
1 power: width 0.254 mm
2 lowpower: width 0.305 mm, drill 0.483 mm

## Board
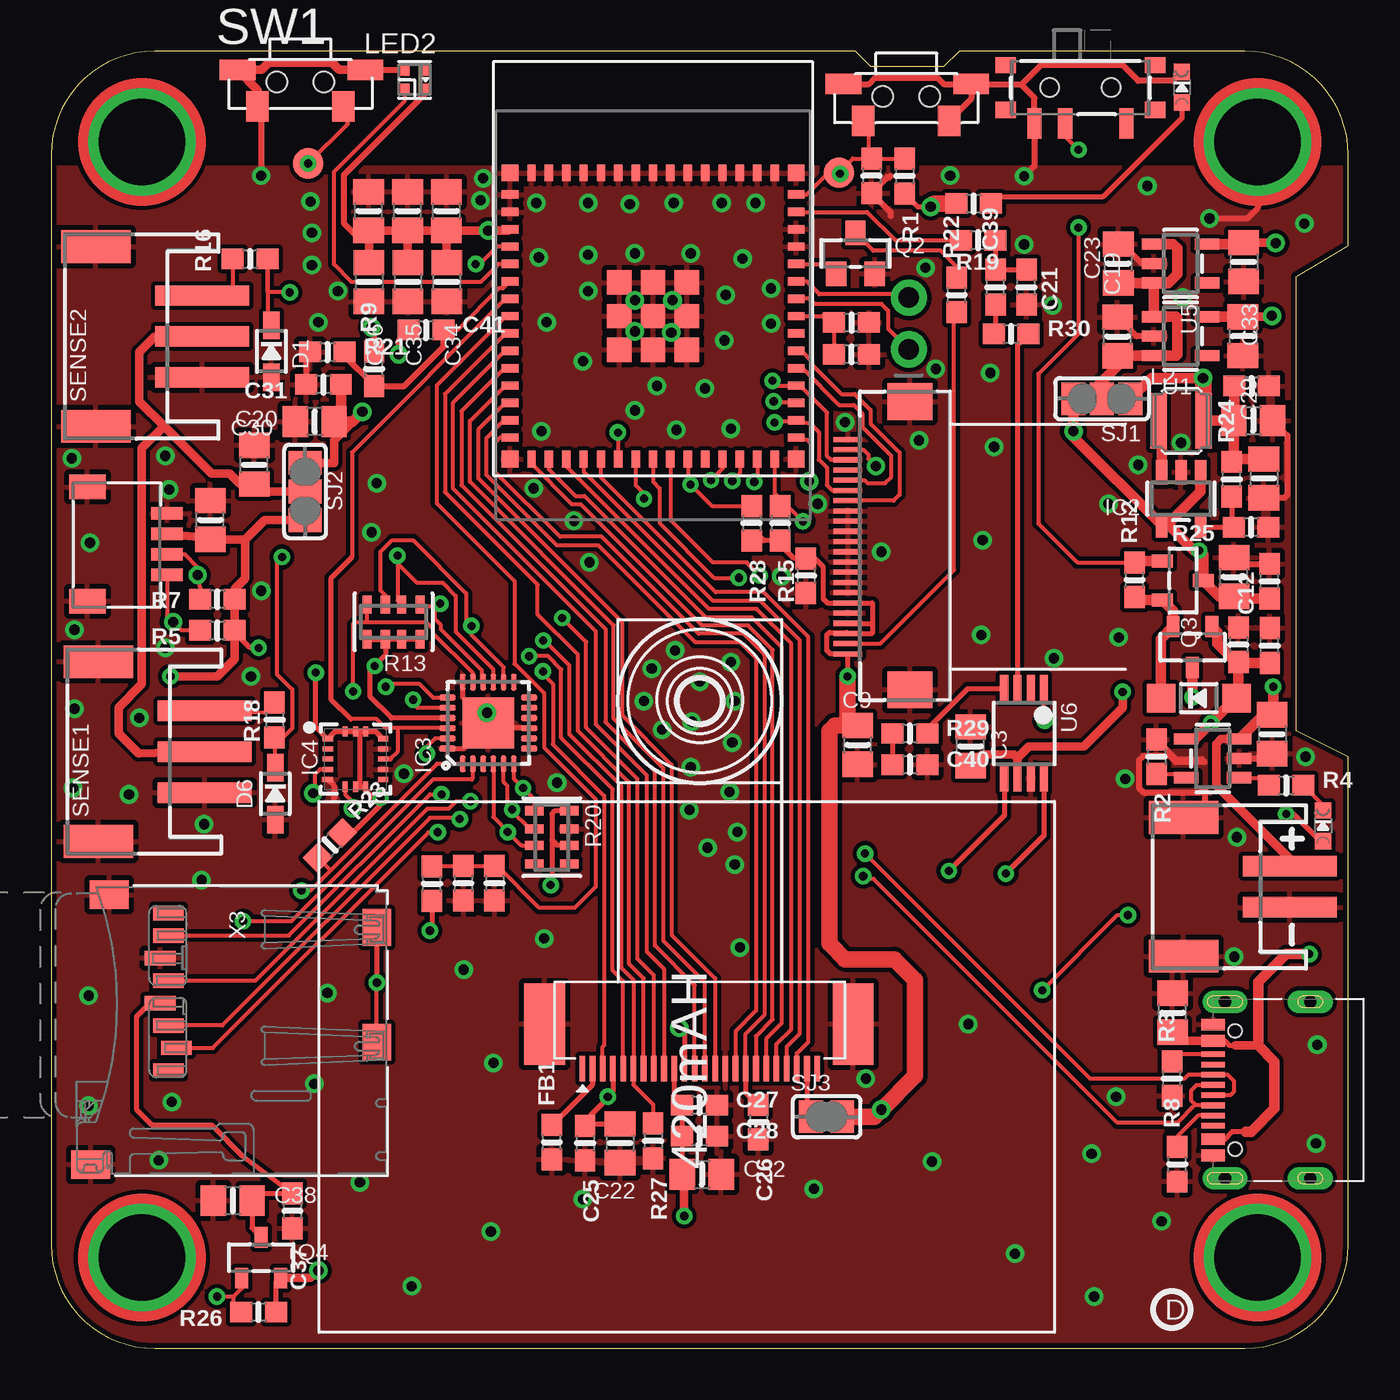
[diagram p2: board, top side]
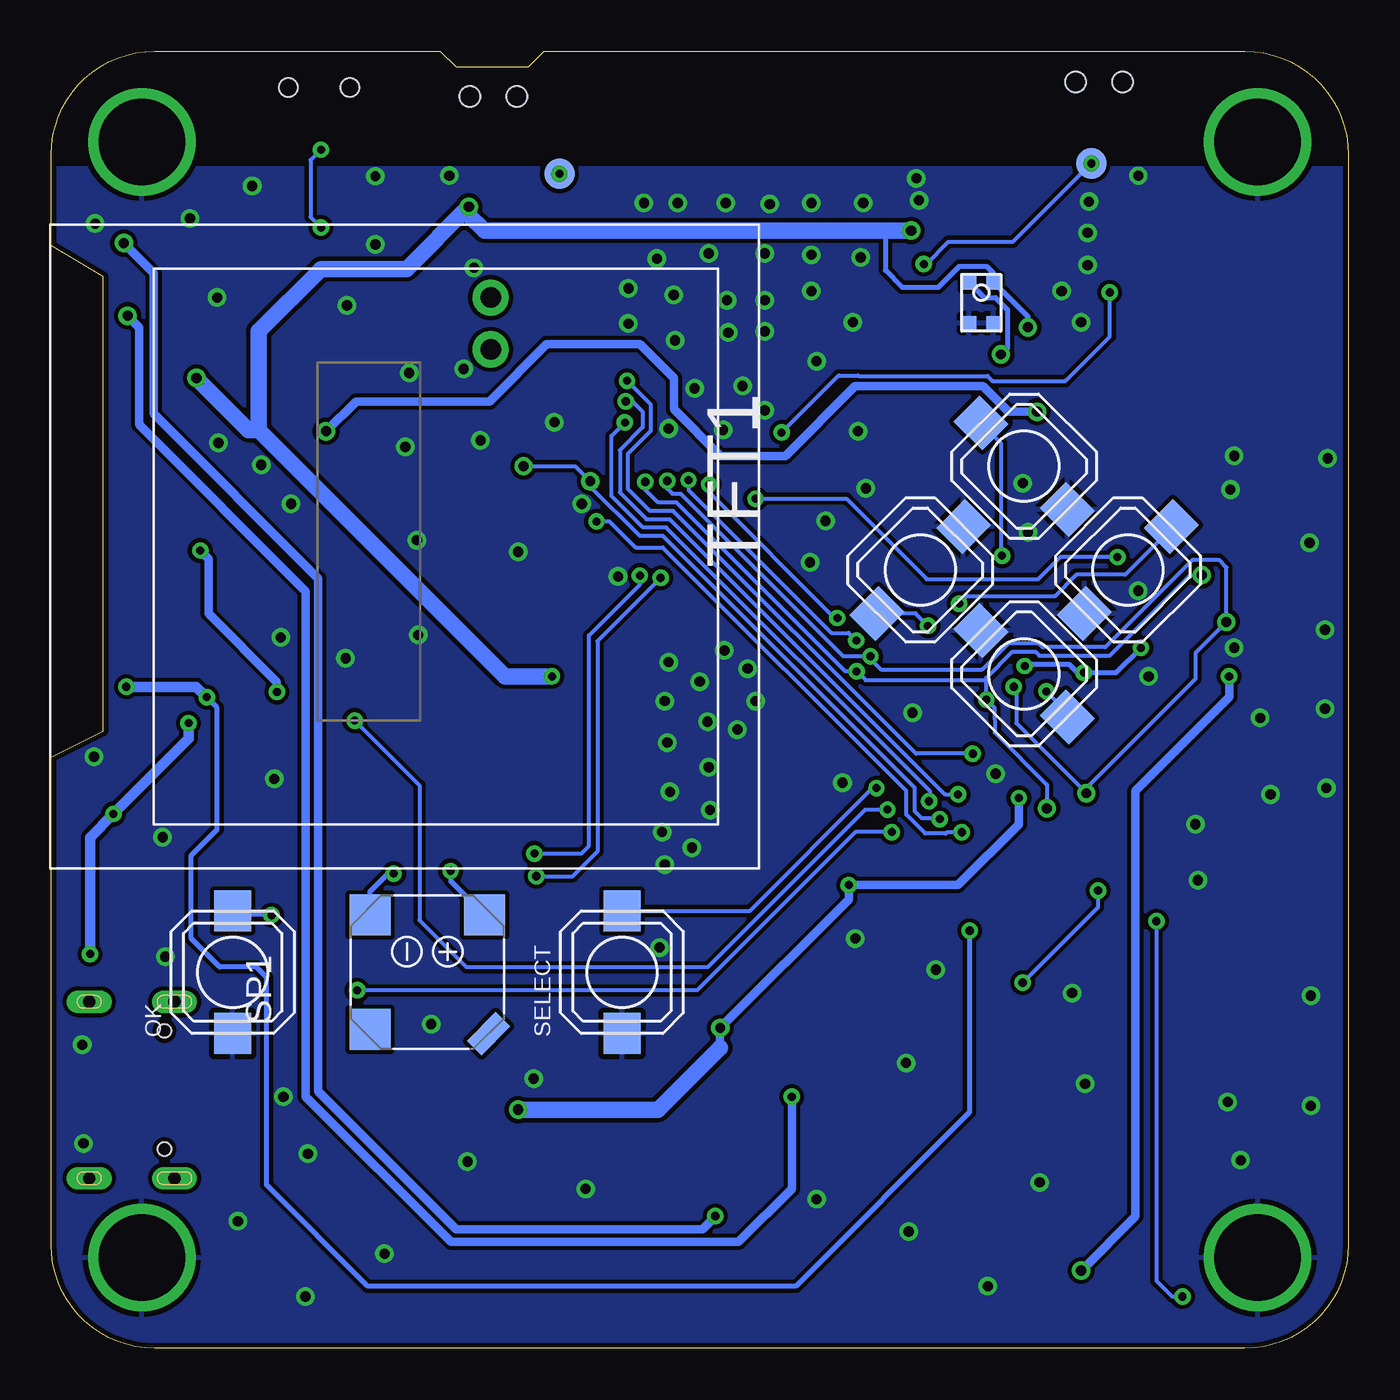
[diagram p3: board, bottom side, seen from below]

Size 63.5 x 63.5 mm. Coordinates in mm from the lower left corner, seen from the top.
Outline: 60.96,52.45 63.5,53.98 63.5,58.42 arc90 58.42,63.5 44.45,63.5 43.69,62.74 40.13,62.74 39.37,63.5 5.08,63.5 arc90 0,58.42 0,5.08 arc90 5.08,0 58.42,0 arc90 63.5,5.08 63.5,28.96 60.96,30.23 60.96,52.45
Copper layers (1*16): Top 0.035mm / dielectric 1.5mm / Bottom 0.035mm
Design rules "adafruit *": minimum track width 8mil, minimum drill 15.5mil, track to track 8mil, track to pad 8mil, pad to pad 8mil, via to via 8mil, smd to smd 8mil, copper to edge 10mil, drill to drill 8mil, minimum pad ring 10mil, minimum via ring 8mil, stop-mask expansion 2mil, vias tented up to drill 20mil, thermal gap 10mil

### Footprints (pad centres in the part's own frame; a part is rotated, then mirrored left to right if it is on the bottom)
0805-NO = smd 1.24 x 1.5: 1 -0.95,0; 2 0.95,0
0603-NO = smd 1.075 x 1: 1 -0.85,0; 2 0.85,0
CHIPLED_0603_NOOUTLINE = smd 0.8 x 0.8: A 0,-0.75; C 0,0.75
JST_SH4 = smd 0.6 x 1.55: 1 -1.5,2.006; 2 -0.5,2.006; 3 0.5,2.006; 4 1.5,2.006 | smd 1.2 x 1.8: MT1 -2.8,-1.894; MT2 2.8,-1.894
SOD-323 = smd 1.35 x 0.8: A 1.27,0; C -1.27,0
SOD-123 = smd 1.4 x 1.4: A 1.85,0; C -1.85,0
TL9210 = smd 2 x 1.8: 1 -3,0; 2 3,0
SOT23-5 = smd 0.55 x 1.2: 1 -0.95,-1.3; 2 0,-1.3; 3 0.95,-1.3; 4 0.95,1.3; 5 -0.95,1.3
QFN24_4MM_SMSC = smd 0.8 x 0.28: 1 -2,1.25; 2 -2,0.75; 3 -2,0.25; 4 -2,-0.25; 5 -2,-0.75; 6 -2,-1.25; 13 2,-1.25; 14 2,-0.75; 15 2,-0.25; 16 2,0.25; 17 2,0.75; 18 2,1.25 | smd 0.28 x 0.8: 7 -1.25,-2; 8 -0.75,-2; 9 -0.25,-2; 10 0.25,-2; 11 0.75,-2; 12 1.25,-2; 19 1.25,2; 20 0.75,2; 21 0.25,2; 22 -0.25,2; 23 -0.75,2; 24 -1.25,2 | smd 2.5 x 2.5: THERM 0,0
LGA16_3X3MM = smd 0.5 x 0.25: 1 -1.35,1; 2 -1.35,0.5; 3 -1.35,0; 4 -1.35,-0.5; 5 -1.35,-1; 9 1.35,-1; 10 1.35,-0.5; 11 1.35,0; 12 1.35,0.5; 13 1.35,1 | smd 0.25 x 0.5: 6 -0.5,-1.35; 7 0,-1.35; 8 0.5,-1.35; 14 0.5,1.35; 15 0,1.35; 16 -0.5,1.35
1X02_ROUND = drill 1 pad 1.778: 1 -1.27,0; 2 1.27,0
INDUCTOR_TAIYOYUDEN_NR3015 = smd 0.8 x 2.7: P$1 -1.1,0; P$2 1.1,0
SK6805_1515 = smd 0.5 x 0.5: 1 -0.5,-0.45; 2 0.5,-0.45; 3 0.5,0.45; 4 -0.5,0.45
SOT23-R = smd 0.635 x 1.016: 1 -0.95,-1; 2 0.95,-1; 3 0,1
SOT23-WIDE = smd 1 x 1.2: 1 -0.95,-1; 2 0.95,-1; 3 0,1
RESPACK_4X0603 = smd 0.45 x 0.9: 1 -1.3,-0.85; 2 -0.4,-0.85; 3 0.4,-0.85; 4 1.3,-0.85; 5 1.3,0.85; 6 0.4,0.85; 7 -0.4,0.85; 8 -1.3,0.85
JSTPH3 = smd 1 x 4.6: 1 -2,-2.7; 2 0,-2.7; 3 2,-2.7 | smd 1.6 x 3.4: NC1 -4.4,2.5; NC2 4.4,2.5
SOLDERJUMPER_2WAY_OPEN_NOPASTE = smd 1.168 x 1.6: 1 -1.397,0; 2 0,0; 3 1.397,0
SOLDERJUMPER_CLOSEDWIRE = smd 1.168 x 1.6: 1 -0.762,0; 2 0.762,0 | smd 0.635 x 0.203: WIRE 0,0
BUZZER_SMT_7.5MM = smd 2 x 2: + 2.8,-2.8; - 2.8,2.8; MT2 -2.8,2.8 | smd 2 x 1 rotated 135: MT -3,-3
SPST_TACTILE_RA = smd 1.1 x 1.5: 1 2.1,-0.9; 2 -2.1,-0.9 | smd 1.75 x 1: MT1 3.175,0.9; MT2 -3.075,0.9 | hole 1: 1.15,0.3; -1.15,0.3
SPDT_SMT_SSSS811101 = smd 0.7 x 1.5: A -2.25,1.242; B 0.75,1.242; C 2.25,1.242 | smd 1 x 0.8: SUP1 -3.65,0.592; SUP2 -3.65,-1.608; SUP3 3.65,0.592; SUP4 3.65,-1.608 | hole 0.9: -1.5,-0.508; 1.5,-0.508
TFT_1.54IN_240X240_22PIN = smd 0.25 x 1.4 bottom: 1 5.25,1.198; 2 4.75,1.198; 3 4.25,1.198; 4 3.75,1.198; 5 3.25,1.198; 6 2.75,1.198; 7 2.25,1.198; 8 1.75,1.198; 9 1.25,1.198; 10 0.75,1.198; 11 0.25,1.198; 12 -0.25,1.198; 13 -0.75,1.198; 14 -1.25,1.198; 15 -1.75,1.198; 16 -2.25,1.198; 17 -2.75,1.198; 18 -3.25,1.198; 19 -3.75,1.198; 20 -4.25,1.198; 21 -4.75,1.198; 22 -5.25,1.198 | smd 1.8 x 2.2 bottom: SUPPORT1 7,-1.852; SUPPORT2 -7.1,-1.852
TESTPOINT_ROUND_1.5MM_NO = smd 1.5 x 1.5: P$1 0,0
SMT_NUT_3MM = drill 4.25 pad 4.572: P$1 0,0
ESP32-S2-MINI-1 = smd 0.813 x 0.406: 1 -7,5.931; 2 -7,5.081; 3 -7,4.231; 4 -7,3.381; 5 -7,2.531; 6 -7,1.681; 7 -7,0.831; 8 -7,-0.019; 9 -7,-0.869; 10 -7,-1.719; 11 -7,-2.569; 12 -7,-3.419; 13 -7,-4.269; 14 -7,-5.119; 15 -7,-5.969; 31 7,-5.969; 32 7,-5.119; 33 7,-4.269; 34 7,-3.419; 35 7,-2.569; 36 7,-1.719; 37 7,-0.869; 38 7,-0.019; 39 7,0.831; 40 7,1.681; 41 7,2.531; 42 7,3.381; 43 7,4.231; 44 7,5.081; 45 7,5.931 | smd 0.406 x 0.813: 16 -5.95,-7.019; 17 -5.1,-7.019; 18 -4.25,-7.019; 19 -3.4,-7.019; 20 -2.55,-7.019; 21 -1.7,-7.019; 22 -0.85,-7.019; 23 0,-7.019; 24 0.85,-7.019; 25 1.7,-7.019; 26 2.55,-7.019; 27 3.4,-7.019; 28 4.25,-7.019; 29 5.1,-7.019; 30 5.95,-7.019; 46 5.95,6.981; 47 5.1,6.981; 48 4.25,6.981; 49 3.4,6.981; 50 2.55,6.981; 51 1.7,6.981; 52 0.85,6.981; 53 0,6.981; 54 -0.85,6.981; 55 -1.7,6.981; 56 -2.55,6.981; 57 -3.4,6.981; 58 -4.25,6.981; 59 -5.1,6.981; 60 -5.95,6.981 | smd 1.194 x 1.194: 61 0,-0.019; 66 -1.65,1.631; 67 0,1.631; 68 1.65,1.631; 69 -1.65,-0.019; 70 1.65,-0.019; 71 -1.65,-1.669; 72 0,-1.669; 73 1.65,-1.669 | smd 0.813 x 0.813: 62 -7,6.981; 63 -7,-7.019; 64 7,-7.019; 65 7,6.981
MSOP8_0.65MM = smd 0.4 x 1.3: 1 -0.975,-2.2; 2 -0.325,-2.2; 3 0.325,-2.2; 4 0.975,-2.2; 5 0.975,2.2; 6 0.325,2.2; 7 -0.325,2.2; 8 -0.975,2.2
MEMS_MIC_2.75X1.85 = smd 0.7 x 0.7: 1 0.6,1; 2 0.6,-1; 3 -0.6,-1; 4 -0.6,1
JSTPH2_BATT = smd 1 x 4.6: 1 -1,-2.303; 2 1,-2.303 | smd 1.6 x 3.4: NC1 -3.4,2.897; NC2 3.4,2.897
OV2640FSL = smd 0.275 x 1.25: 1 5.75,0.98; 2 5.25,0.98; 3 4.75,0.98; 4 4.25,0.98; 5 3.75,0.98; 6 3.25,0.98; 7 2.75,0.98; 8 2.25,0.98; 9 1.75,0.98; 10 1.25,0.98; 11 0.75,0.98; 12 0.25,0.98; 13 -0.25,0.98; 14 -0.75,0.98; 15 -1.25,0.98; 16 -1.75,0.98; 17 -2.25,0.98; 18 -2.75,0.98; 19 -3.25,0.98; 20 -3.75,0.98; 21 -4.25,0.98; 22 -4.75,0.98; 23 -5.25,0.98; 24 -5.75,0.98 | smd 2 x 4: SPRT1 7.6,-1.21; SPRT2 -7.51,-1.21
MICROSD = smd 0.7 x 1.5: 1 1.761,-3.147; 2 0.661,-2.747; 3 -0.439,-3.147; 4 -1.539,-3.547; 5 -2.639,-3.147; 6 -3.739,-3.547; 7 -4.839,-3.147; 8 -5.939,-3.147 | smd 1.8 x 1.4: CD1 -5.239,7.053; CD2 0.38,7.053 | smd 1.4 x 1.9: MT1 -6.839,-6.047; MT2 6.361,-6.947
USB_C_CUSB31-CFM2AX-01-X = smd 0.575 x 1.15: A1B12 -3.2,2.275; A4B9 -2.4,2.275; B1A12 3.2,2.275; B4A9 2.4,2.275 | smd 0.275 x 1.15: A5 -1.25,2.275; A6 -0.25,2.275; A7 0.25,2.275; A8 1.25,2.275; B5 1.75,2.275; B6 0.75,2.275; B7 -0.75,2.275; B8 -1.75,2.275 | drill 0.6 pad 1 long: M1 -4.32,1.7; M2 4.32,1.7; M3 -4.32,-2.48; M4 4.32,-2.48 | hole 0.65: 2.89,1.2; -2.89,1.2

### Placement (x,y rotation side)
C1  54.89,16.43 90 top
C2  36.94,37.82 270 top
C3  45.01,29.46 90 top
C4  59.36,42.58 270 top
C5  58.76,47.1 0 top
C6  39.18,50.22 0 top
C7  17.45,55.66 90 top
C8  59.77,30.06 270 top
C9  39.48,29.54 90 top
C10  19.35,55.66 90 top
C11  57.9,37.76 90 top
C12  59.64,37.55 90 top
C13  58.84,45.42 0 top
C14  40.16,57.39 270 top
C15  59.65,34.4 90 top
C16  20.18,22.77 270 top
C17  15.54,55.66 90 top
C18  7.8,40.55 90 top
C19  52.2,49.53 90 top
C20  9.94,43.26 90 top
C21  47.74,51.94 90 top
C22  27.85,10.05 270 top
C23  52.24,53.1 90 top
C25  26.14,10.05 270 top
C26  34.62,11.07 270 top
C27  31.74,11.91 0 top
C28  31.74,10.39 0 top
C29  58.33,49.54 270 top
C30  12.9,45.36 180 top
C31  13.34,47.18 180 top
C32  31.85,8.52 0 top
C33  58.37,53.17 270 top
C34  19.37,52.2 270 top
C35  17.46,52.2 270 top
C36  15.56,52.2 270 top
C37  11.81,6.73 270 top
C38  8.89,7.24 0 top
C39  46.23,51.94 90 top
C40  42.04,28.57 0 top
C41  18.35,49.85 0 top
CHG1  62.26,25.58 0 top
CONN1  3.67,39.37 270 top
D1  10.78,48.81 270 top
D4  56.17,31.83 0 top
D6  10.97,27.15 270 top
DOWN  15.88,33.02 315 bottom
FB1  24.51,10.1 90 top
IC2  55.31,41.59 180 top
IC3  21.4,30.61 90 top
IC4  14.9,28.84 0 top
JP2  41.99,50.16 90 top
L2  55.31,45.4 0 top
LED2  17.79,62.1 0 top
LEFT  10.79,38.1 45 bottom
OK  54.61,18.41 90 bottom
ON  55.35,61.73 0 top
Q1  55.87,34.33 180 top
Q2  39.37,53.59 0 top
Q3  55.4,37.58 270 top
Q4  10.29,4.45 0 top
R1  41.77,57.38 270 top
R2  54.1,28.96 270 top
R3  54.86,13.21 90 top
R4  60.45,27.56 0 top
R5  8.14,35.14 180 top
R6  45.16,56.03 180 top
R7  8.14,36.66 180 top
R8  55.12,9.02 90 top
R9  15.81,47.94 90 top
R10  18.64,22.75 90 top
R11  21.7,22.77 270 top
R12  53.04,37.62 90 top
R13  16.76,35.56 180 top
R14  58.12,34.44 270 top
R15  35.69,40.39 270 top
R16  9.74,53.33 0 top
R17  39.18,48.65 180 top
R18  10.93,30.76 270 top
R19  45.38,54.24 180 top
R20  24.51,25.02 270 top
R21  13.53,48.77 0 top
R22  44.32,51.56 90 top
R23  13.65,24.64 45 top
R24  57.78,42.55 90 top
R25  58.74,40.2 180 top
R26  10.16,1.78 180 top
R27  29.46,10.16 270 top
R28  34.29,40.39 270 top
R29  42.04,30.1 0 top
R30  46.99,49.66 0 top
RIGHT  20.95,38.1 225 bottom
SELECT  35.56,18.41 90 bottom
SENSE1  4.81,29.21 90 top
SENSE2  4.69,49.53 90 top
SJ1  51.44,46.48 180 top
SJ2  12.43,41.95 270 top
SJ3  37.96,11.34 0 top
SP1  45.09,18.41 90 bottom
SW1  12.2,61.68 0 top
SW2  41.86,60.99 0 top
SW4  50.38,61.2 180 top
TFT1  40.2,39.24 270 bottom
TP1  12.59,58 0 top
TP2  38.56,57.56 90 top
TP3  4.45,4.45 0 top
TP4  59.05,4.45 0 top
TP5  4.45,59.05 0 top
TP6  59.05,59.05 0 top
TP7  38.62,57.49 270 bottom
TP8  12.59,58 270 bottom
U1  55.28,49.54 270 top
U2  56.86,28.88 90 top
U3  29.46,50.55 0 top
U5  55.28,53.1 270 top
U6  47.62,30.1 180 top
U7  17.97,51.18 0 bottom
U$83  [LIPO_552535]  31.11,13.78 90 top
U$119  [MEMENTO_TOP]  0,0 0 top
U$120  [MEMENTO_BOT]  63.5,0 0 bottom
U$121  [PCBFEAT-REV-040]  54.86,1.91 0 top
UP  15.88,43.18 135 bottom
X1  58.32,22.59 90 top
X2  31.75,14.67 180 top
X3  8.89,15.37 270 top
X4  59.16,12.65 90 top

### Tracks (layer width: path | path; a pad name or v marks a point on that pad's centre or on a via)
1.5V  (via drill 0.4, 0.5)
  Top 0.254: X2.10 30.5,12.3 C27.1 C28.1 30.89,8.54 C32.1
  Top 0.406: C33.1 59.92,54.12 v59.94,54.1 | v30.99,6.48 30.99,8.44 C32.1
  Top 0.508: U5.5 58.29,54.05 C33.1
  Bottom 0.406: v59.94,54.1 58.48,52.64 58.48,45.76 50.42,37.69 50.42,12.57 43.69,5.84 31.62,5.84 v30.99,6.48
2.8V  (via drill 0.4, 0.5)
  Top 0.254: X2.4 27.5,12.57 v27.25,12.32 | 27.3,12.32 26.14,11.15 C25.1 26.24,11 C22.1
  Top 0.406: C29.1 59.7,50.49 v59.75,50.55 | 27.3,12.32 v27.25,12.32
  Top 0.508: U1.5 C29.1
  Bottom 0.406: v59.75,50.55 59.18,49.97 59.18,45.21 51.03,37.06 51.03,12.32 43.91,5.21 29.84,5.21 27.25,7.81 v27.25,12.32
3.3V  (via drill 0.39, 0.48, 0.5)
  Top 0.254: v30.75,15.68 31,15.43 X2.11 | 40.19,35.49 40.19,36.49 TFT1.6 37.99,36.49 37.78,36.7 37.78,38.27 37.07,38.98 36.94,38.85 C2.1 36.36,38.67 35.69,39.35 R15.2 34.89,39.54 34.67,39.75 34.33,39.58 R28.2 | 40.19,35.49 40.19,34.99 TFT1.3 38.94,35.05 38.1,35.05 37.97,34.92 37.97,34.17 38.14,33.99 TFT1.1 38.99,33.98 v38.99,32.89 | TFT1.4 40.19,35.49 | 15.11,30.19 IC4.15 IC4.16 13.9,30.19 IC4.1 12.95,30.43 v12.95,33.08 | 15.11,30.19 IC4.14 15.9,30.19 IC4.13 | 15.11,27.49 IC4.8 15.4,27.34 15.8,26.94 v16.13,26.94 16.13,26.61 14.87,25.35 R23.2 | 15.11,27.49 IC4.7 | 15.11,30.19 15.11,27.49 | v10.16,34.29 9.75,34.29 8.99,35.05 | IC3.21 16.66,30.86 15.6,31.91 15.6,33.18 15.85,33.43 | R13.8 R13.7 R13.6 | R13.6 16.36,33.95 15.85,33.43 | R13.5 R13.6 | R20.6 24.78,24.62 24.51,24.89 | 24.51,24.89 24.51,26.16 24.67,26.32 R20.8 | v15.85,33.4 15.85,33.43 | 24.51,24.89 24.51,22.73 v24.46,22.68 | v15.68,49.98 15.81,49.85 R9.2 | R1.2 42.42,55.88 v43.05,55.88 | R26.1 11.01,3.22 Q4.2
  Top 0.305: LED2.2 18.29,61.4 14.32,57.43 14.32,55.08 14.88,54.52 15.56,54.52 | SJ3.2 39.37,11.34
  Top 0.406: C10.1 v21.4,54.71 22.38,54.71 U3.3 | C10.1 19.36,53.16 C34.1 | C10.1 C7.1 | C7.1 17.46,54.7 C35.1 | C7.1 15.75,54.71 | 15.75,54.71 C17.1 | C36.1 15.56,54.52 15.75,54.71 | CONN1.2 7.75,39.65 C18.1 9.5,39.6 | 9.5,39.6 9.5,37.68 8.99,37.17 R7.1 R5.1 8.99,35.05 8.99,33.76 8.13,32.89 v5.84,32.89 | v13.08,3.81 12.72,3.44 Q4.2 | SJ2.3 10.45,40.55 9.5,39.6
  Top 0.508: L2.P$2 56.42,45.41 C13.1 | C13.1 57.89,43.5 R24.2 57.92,43.53 C4.1 | C5.1 57.91,45.44 C13.1 | SJ1.1 53.85,47.5 v56.39,47.5
  Top 0.813: v43.05,55.88 43.2,56.03 R6.2 | v38.99,32.89 38.99,30.98 C9.2 38.37,30.49 38.1,30.23 38.1,19.81 38.86,19.05 41.27,19.05 42.29,18.03 42.29,13.34 v40.64,11.68 40.3,11.34 39.37,11.34 38.89,11.34 | v56.39,47.5 56.41,47.48 L2.P$2
  Bottom 0.254: v10.16,34.29 11.37,33.08 v12.95,33.08 13.27,33.08 13.66,33.48 15.62,33.48 15.69,33.4 v15.85,33.4 | v15.68,49.98 15.68,50.49 U7.1 17.37,52.62 17.72,52.97 19.04,52.97 20.07,51.94 21.84,51.94 22.67,52.77 22.67,54.71
  Bottom 0.406: 30.75,14.72 v30.75,15.68 24.46,21.98 v24.46,22.68 19.1,22.68 16.13,25.65 v16.13,26.94 | v5.84,32.89 5.84,31.88 10.43,27.29 10.43,6.46 v13.08,3.81
  Bottom 0.813: v21.4,54.71 22.67,54.71 42.29,54.71 43.05,55.48 v43.05,55.88 46.1,52.83 50.29,52.83 53.34,49.78 53.34,44.96 | v38.99,32.89 41.27,32.89 53.34,44.96 | v56.39,47.5 53.85,44.96 53.34,44.96 | v40.64,11.68 33.78,11.68 30.75,14.72
A1_JST1
  Top 0.203: SENSE1.3 10.45,31.12 R18.1
AD0  (via drill 0.39)
  Top 0.203: U3.21 27.76,44.83 v27.74,44.83 | v11.68,51.69 10.61,51.69 R16.2 10.59,50.53 10.91,50.22 10.91,50.2 D1.C
  Bottom 0.203: v27.74,44.83 24.95,47.62 24,47.62 23.98,47.6 17.67,47.6 17.42,47.35 13.87,47.35 11.68,49.53 v11.68,51.69
AD1  (via drill 0.39, 0.4)
  Top 0.203: U3.22 28.61,42.25 28.89,41.97 28.89,41.72 v29.02,41.59 | R18.2 10.97,29.87 D6.C 10.97,29.52 11.81,30.35 11.81,32.26 11.05,33.02 11.05,38.48 v11.3,38.73
  Bottom 0.203: v29.02,41.59 24.57,41.59 20.64,37.66 15.18,37.66 14.1,38.73 v11.3,38.73
AGND
  Top 0.254: FB1.2 24.54,10.95 26.5,12.91 X2.2
BACKLIGHT
  Top 0.203: U3.41 37.94,53.08 Q2.1
BATT_MON
  Top 0.203: U3.8 22.27,50.53 18.87,47.13 18.87,41.37 22.68,37.56 22.68,33.52 24.13,32.07 24.13,29.42 26.67,26.88 26.67,22.61 25.63,21.57 23.89,21.57 21.84,23.62 R11.1 C16.1 18.67,23.62 R10.2
BOOT0/SHUTTER  (via drill 0.39)
  Top 0.203: SW1.1 14.53,59.95 TP8.P$1 | U3.4 21.83,53.93 20.98,53.08 v20.78,53.08
  Bottom 0.203: v20.78,53.08 20.66,53.08 19.58,54.16 16.43,54.16 TP8.P$1
  other vias: 12.59,58
BUTTONOK  (via drill 0.39, 0.4)
  Top 0.203: IC3.4 21.65,26.01 22.37,25.29 v22.35,25.27 23.01,24.62 R20.3 | v48.51,17.53 52.2,21.21 v52.7,21.21
  Bottom 0.203: v22.35,25.27 24.13,25.27 31.88,17.53 v48.51,17.53 | OK.2 54.4,21.21 v52.7,21.21
BUTTONSEL  (via drill 0.39)
  Top 0.203: IC3.6 22.65,27.88 v23.1,27.42 23.66,26.87 R20.1
  Bottom 0.203: SELECT.2 29.3,21.41 23.3,27.42 v23.1,27.42
CAM_PWDN  (via drill 0.39)
  Top 0.203: X2.8 29.5,18.27 28.7,19.07 28.7,27.88 26.19,30.39 26.19,34.58 v25.02,35.75 | U3.25 31.16,42.42 v31.29,42.29 32.35,41.24 R28.1
  Bottom 0.203: v31.29,42.29 31.33,42.25 31.33,41.94 25.15,35.75 v25.02,35.75
CAM_RST  (via drill 0.39)
  Top 0.203: U3.27 32.86,43.07 v32.3,42.51 | v24.09,34.65 24.15,34.65 25.38,33.43 25.38,30.06 27.89,27.54 27.89,18.66 28.5,18.05 X2.6 28.5,12.9 29.46,11.94 R27.1
  Bottom 0.203: v32.3,42.51 32.3,42.02 25.31,35.03 24.47,35.03 v24.09,34.65
CARD_CS  (via drill 0.39)
  Top 0.203: X3.2 7.91,14.71 18.47,25.27 v18.92,25.27 | R15.1 36.04,41.24 v36.8,40.48 35.41,41.87 U3.30
  Bottom 0.203: v18.92,25.27 19.64,25.27 19.71,25.2 20.71,25.2 21.64,26.13 21.64,27.28 33.56,39.21 34.9,39.21 36.17,40.48 v36.8,40.48
CARDDET  (via drill 0.4)
  Top 0.203: IC3.1 18.89,28.61 13.68,23.4 | X3.CD2 v15.94,17.91 | 13.68,23.4 12.69,22.42 v12.26,22.42 | R23.1 13.68,23.41 13.68,23.4
  Top 0.254: X3.CD1 v15.94,17.91
  Bottom 0.203: v12.26,22.42 12.26,21.59 v15.94,17.91
CC1
  Top 0.203: R8.2 55.12,10.38 56.14,11.4 X4.A5
CC2
  Top 0.203: R3.2 55.2,14.4 X4.B5
D10_JST
  Top 0.203: SENSE2.3 8.89,51.57 R16.1
D+  (via drill 0.39, 0.4)
  Top 0.203: U3.24 30.31,40.55 32.4,38.47 34.05,38.47 v34.68,37.83 | v39.84,24.22 50.86,13.2 55.48,13.2 55.67,13.4 X4.B6 57.59,13.4 57.91,13.08 57.91,12.57 57.74,12.4 X4.A6
  Bottom 0.203: v34.68,37.83 34.68,37.39 37.17,34.9 37.17,24.6 37.55,24.22 v39.84,24.22
D-  (via drill 0.39, 0.4)
  Top 0.203: v33.66,37.72 32.45,37.72 29.79,40.39 29.79,42.1 29.46,42.42 U3.23 | X4.B7 56.05,11.9 | X4.A7 56.08,12.9 55.82,12.64 55.82,12.13 56.05,11.9 | 56.05,11.9 55.97,11.9 55.12,11.05 52.2,11.05 40.26,22.98 39.88,22.98 v39.75,23.11
  Bottom 0.203: v33.66,37.72 36.77,34.62 36.77,24.32 37.97,23.11 v39.75,23.11
DATA1
  Top 0.254: X2.23 37,11.54 SJ3.1
DATA2
  Top 0.203: U3.17 24.36,43.02 25.66,41.72 26.1,41.72 32.03,35.8 34.29,35.8 35.76,34.32 35.76,15.91 35,15.15 X2.19
DATA3
  Top 0.203: U3.19 26.06,42.91 32.36,36.61 34.7,36.61 36.63,34.67 36.63,15.4 36,14.77 X2.21
DATA4
  Top 0.203: X2.22 36.5,14.45 37.07,15.02 37.07,34.82 34.87,37.01 32.53,37.01 26.91,42.63 U3.20
DATA5
  Top 0.203: U3.18 25.21,43.18 32.2,36.2 34.53,36.2 36.2,34.53 36.2,15.6 35.5,14.89 X2.20
DATA6
  Top 0.203: U3.16 23.51,43.3 25.5,41.31 25.93,41.31 31.86,35.39 34.12,35.39 35.32,34.19 35.32,16.1 34.5,15.28 X2.18
DATA7
  Top 0.203: U3.14 22.18,45.43 21.31,44.55 21.31,42.76 24.75,39.32 26.78,39.32 31.52,34.58 33.72,34.58 34.51,33.79 34.51,16.54 33.5,15.53 X2.16
DATA8
  Top 0.203: U3.13 22.21,46.28 20.9,44.97 20.9,42.59 27.94,35.55 27.94,31 30.37,28.57 30.37,20.25 32.51,18.11 32.51,14.58 32.5,14.58 X2.14
DATA9
  Top 0.203: U3.11 22.2,47.98 20.09,45.87 20.09,42.25 27.13,35.22 27.13,30.66 29.56,28.23 29.56,19.72 31.5,17.78 X2.12
DOWN  (via drill 0.39)
  Top 0.203: v14.78,32.16 14.78,35.43 14.91,35.56 15.46,35.56 | IC3.17 20.65,33.05 18.68,35.02 18.68,35.23 18.35,35.56 15.46,35.56 | 15.46,35.56 R13.4
  Bottom 0.203: DOWN.2 13.75,31.14 v14.78,32.16
EN  (via drill 0.39)
  Top 0.203: v50.29,58.67 49.63,59.34 SW4.B | v50.29,54.86 50.29,49.66 48.32,47.69 48.32,40.38 50.24,38.47 R12.2
  Top 0.508: R12.2 53.1,38.53 Q3.1
  Bottom 0.203: v50.29,58.67 50.8,58.17 50.8,55.37 v50.29,54.86
EXT_XCLK
  Top 0.203: U3.12 22.23,47.13 20.5,45.39 20.5,42.42 27.53,35.38 27.53,30.83 29.96,28.4 29.96,19.95 32,17.91 X2.13
FB
  Top 0.254: IC2.5 56.35,40.2 R25.2 57.78,40.3 R24.1
GND  (via drill 0.48, 0.5)
  Top 0.254: IC3.9 21.65,30.36 | IC3.18 20.15,31.86 20.89,31.11 v21.34,31.11 21.34,30.67 IC3.THERM 21.4,30.54 20.21,29.36 IC3.24
  Top 0.305: SW1.2 10.29,60.81 v10.29,57.4 | v47.62,57.38 48.13,57.89 SW4.C 48.13,61.22 47.5,61.85 | IC4.5 13.84,27.55 13.84,26.92 | LED2.4 15.41,62.55 SW1.MT1 | 12.48,48.86 C31.2 | U2.2 59.53,28.88 C8.2 | SW2.MT2 40.03,61.88 40.33,62.19 43.38,62.19 43.69,61.88 SW2.MT1 45.03,61.85 | 45.03,61.85 45.03,61.16 SW2.1 | 41.08,55.44 41.08,55.61 C14.2 40.96,57.34 41.04,57.34 41.08,57.38 | TP6.P$1 59.05,55.82 58.55,55.31 v56.71,55.31 | ON.C 54.9,62.04 53.21,62.04 52.45,62.8 48.45,62.8 47.5,61.85 | 47.5,61.85 45.03,61.85 | U5.2 53.39,53.1 52.44,54.05 C23.2 | U1.2 53.13,49.54 C19.2 | C13.2 60.52,44.69 60.52,41.78 60.37,41.63 C4.2 | C11.2 58.2,38.4 C12.2 | R2.1 55.08,28.83 56.34,28.83 56.46,28.7 55.05,28.7 54.75,29 53.45,29 53.25,28.79 53.25,27.42 53.45,27.21 56.22,27.21 56.44,27.43 56.46,27.43 56.46,25.91 55.51,25.91 X1.NC2
  Top 0.406: 21.65,30.36 IC3.THERM | SW1.2 10.11,61.58 10.1,61.59 10.1,61.62 SW1.MT2 10.3,62.58 10.66,62.94 13.75,62.94 14.11,62.58 SW1.MT1
  Bottom 0.305: 47.52,57.28 v47.62,57.38
  other vias: 24.77,27.69 17.27,28.13 5.59,43.69 1.02,43.56 1.14,35.18 13.08,50.23 23.62,42.1 38.86,45.34 35.75,37.78 40.64,38.99 9.78,32.89 4.32,30.86 7.49,25.65 39.88,13.21 24.13,20.07 37.53,41.34 33.72,19.62 33.46,23.69 33.59,25.27 32.13,24.51 31.24,26.35 33.21,27.24 31.31,28.45 33.34,29.65 31.37,30.67 33.46,31.69 33.27,33.59 29.4,33.27 30.54,34.16 31.75,32.64 61.98,14.86 61.91,10.03 43.31,47.94 42.8,52.9 34.48,56.07 32.83,56.07 30.48,56.07 28.32,56.01 26.29,56.07 23.75,56.07 23.88,53.4 26.29,51.75 24.26,50.23 26.04,48.32 24,44.89 28.57,45.91 29.65,47.12 30.61,44.96 33.27,45.02 32,46.99 35.24,50.16 32.96,49.34 33.02,51.56 35.24,51.88 33.85,53.34 31.31,53.59 28.57,53.59 26.29,53.53 28.57,51.31 28.57,49.78 30.35,49.72 30.42,51.31 21.15,57.28 21.02,56.2 12.7,56.13 12.76,54.61 12.76,53.02 14.03,51.75 44.01,57.4 47.62,54.04 46.16,44.13 45.53,34.92 49.09,33.78 58.04,25.02 52.26,34.8 55.31,44.32 49.02,51.05 45.97,47.75 53.66,56.9 61.34,55.05 61.4,28.96 12.89,12.95 13.53,17.4 7.37,22.92 1.84,17.27 1.84,11.87 5.91,12.06 5.27,9.21 1.08,27.43 1.14,31.31 1.91,39.43 5.78,42.04 5.59,34.29 3.81,27.11 26.35,38.48 15.94,42.35 25.59,40.51 29.02,31.69 29.91,30.29 57.91,19.18 51.75,41.34 53.21,43.24 55.37,51.44 42.48,44.45 44.89,15.88 43.12,9.14 37.34,7.81 21.65,13.97 20.19,18.54 26.04,7.3 21.53,5.71 15.11,8.13 17.65,3.05 47.18,4.64 50.93,9.53 54.36,6.22 51.05,2.54 52.58,27.88 15.68,39.94 10.29,37.08 52.13,12.32 45.59,39.56
  pour Bottom: 0,-0.13 63.56,-0.13 63.56,57.78 0,57.78
  pour Top: 0,-0.13 63.56,-0.13 63.56,57.78 0,57.78
HSYNC
  Top 0.203: U3.10 22.22,48.83 19.68,46.3 19.68,42.08 26.67,35.1 26.67,30.54 29.15,28.06 29.15,19.42 30,18.57 X2.9
IO42_DBLTAP
  Top 0.203: U3.38 37.73,50.53 38.18,50.07 C6.1 R17.2
IRQ
  Top 0.203: U3.7 22.25,51.38 14.73,43.85 14.73,38.73 | IC3.22 16.95,30.36 | 16.95,30.36 16.38,30.36 15.94,30.8 14.67,30.8 | 16.95,30.36 16.95,29.2 16.6,28.84
  Top 0.254: 16.6,28.84 IC4.11 | 14.67,30.8 13.72,31.75 13.72,37.72 14.73,38.73
LED_K
  Top 0.203: TFT1.2 40.59,34.49 44.2,38.1 44.2,50.59 R22.1
LEFT  (via drill 0.39)
  Top 0.203: 18.8,36.32 18.8,36.45 v19.05,36.45 | 18.8,36.32 18.15,36.32 R13.1 | IC3.16 21.09,32.66 21.09,33.18 19.09,35.19 19.09,35.4 18.8,35.69 18.8,36.32
  Bottom 0.203: LEFT.2 8.67,40.12 10.92,37.87 13.31,37.87 14.35,36.83 18.67,36.83 v19.05,36.45
MIC
  Top 0.203: U3.6 22.12,51.88 21.93,51.88 19.89,49.85 C41.2
  Top 0.305: R21.2 14.38,48.58 15.81,47.14 R9.1 17.27,47.09 19.2,49.02 C41.2
MISO  (via drill 0.4)
  Top 0.203: X3.7 11.63,20.21 18.54,27.11 v19.11,27.11 | U3.33 36.45,46.29 35.43,46.29 v35.37,46.35
  Bottom 0.203: v19.11,27.11 19.75,27.11 33.23,40.59 34.36,40.59 35.66,41.89 35.66,43.97 34.54,45.09 34.54,45.85 35.05,46.35 v35.37,46.35
MOSI  (via drill 0.4, 0.48)
  Top 0.203: v40.37,43.18 40,43.55 40,43.74 39.75,43.99 TFT1.21 | v37.11,42.45 37.17,42.51 37.17,44.31 37.02,44.47 U3.31 | X3.3 8.38,15.81 18.55,25.97 19.94,25.97 v20,25.91
  Bottom 0.203: v40.37,43.18 37.85,43.18 v37.11,42.45 37.11,42.19 34.7,39.78 33.56,39.78 21.23,27.45 21.23,26.3 20.91,25.97 20.07,25.97 v20,25.91
N$1  (via drill 0.48)
  Top 0.254: v17,48.66 17,49.35 C41.1
  Bottom 0.254: U7.4 17.82,51.44 17.27,51.44 16.69,50.85 16.69,48.97 v17,48.66
N$2
  Top 0.203: 12.45,42.55 12.45,42.74
N$3
  Top 0.254: ON.A 55.35,60.22 51.47,56.35 46.33,56.35 R6.1
N$4
  Top 0.203: U2.1 59.23,27.93 R4.1
N$5
  Top 0.203: Q2.3 40.24,53.72 43.56,53.72 44.32,52.96 R22.2
N$6
  Top 0.203: R4.2 62.26,26.61 CHG1.C
N$7
  Top 0.254: R29.2 42.89,30.31 44.87,32.3 U6.4
N$8
  Top 0.254: R30.2 47.3,49.12 U6.3
N$9
  Top 0.203: R2.2 55.38,28.11 U2.5
N$10
  Top 0.254: R29.1 C40.1
N$11  (via drill 0.39)
  Top 0.254: v46.74,23.24 48.6,25.11 U6.8
  Bottom 0.254: v46.74,23.24 47,23.24 47.88,22.36 SP1.-
N$12  (via drill 0.39)
  Top 0.254: U6.5 46.65,26.08 v43.94,23.37
  Bottom 0.254: v43.94,23.37 43.94,22.87 SP1.+
N$13
  Top 0.254: C39.1 46.23,49.74 R30.1
N$14
  Top 0.254: R19.1 C39.2 C21.2
N$15
  Top 0.508: IC2.3 54.36,45.25 L2.P$1
N$16
  Top 0.254: 52.01,46.48 52.26,46.48
N$21
  Top 0.508: D4.C 54.32,34.73 Q1.2 54.92,36.11 Q3.2 53.17,36.63 R12.1
NEOPIXEL
  Top 0.203: U3.5 21.9,53.08 21.02,52.2 14.71,52.2 13.84,53.06 13.84,57.59 17.29,61.04 LED2.1
PCLK
  Top 0.203: U3.15 21.97,44.58 21.72,44.32 21.72,42.93 24.92,39.73 26.95,39.73 31.69,34.98 33.89,34.98 34.91,33.96 34.91,16.32 34,15.4 X2.17
  Top 0.254: C26.1 34,12.54 X2.17
PERIPH_RST  (via drill 0.39)
  Top 0.203: TFT1.20 38.17,43.49 37.99,43.67 37.99,45.79 36.66,47.13 U3.34 35.54,47.13 v35.31,47.36 | IC3.23 18.81,29.86 18.39,29.44 v18.39,29.11
  Bottom 0.203: v18.39,29.11 21.17,29.11 33.06,41 34.19,41 35.26,42.06 35.26,43.8 34.14,44.92 34.14,46.19 v35.31,47.36
RESET  (via drill 0.39)
  Top 0.203: U3.45 36.97,56.48 38.05,57.56 TP2.P$1 38.62,57.62 | 40.01,58.24 39.24,58.24 38.89,57.89 38.62,57.62 | 40.01,58.24 C14.1 41.76,58.24 R1.1 | SW2.2 40.01,59.84 40.01,58.24 | TP7.P$1 38.62,57.62
  other vias: 38.62,57.49
RIGHT  (via drill 0.39)
  Top 0.203: IC3.14 22.15,33.35 20.58,34.92 v20.58,35.37 20.32,35.62 20.32,36.95 17.72,39.56 16.7,39.56 16.11,38.97 16.11,37.11 16.36,36.85 R13.3
  Bottom 0.203: v20.58,35.37 21.19,35.98 RIGHT.2
RXD0
  Top 0.203: U3.40 36.97,52.23 37.61,51.59 41.83,51.59 JP2.2
SCK  (via drill 0.4)
  Top 0.203: TFT1.17 38.24,41.99 37.97,42.26 37.97,43.11 37.58,43.51 37.58,44.84 37.16,45.27 U3.32 36.46,45.4 36.43,45.36 35.45,45.36 v35.41,45.32 | X3.5 10.01,18.01 18.41,26.41 19.45,26.41 19.83,26.78 v20.53,26.78
  Bottom 0.203: v20.53,26.78 20.46,26.84 20.46,27.25 33.39,40.18 34.53,40.18 36.07,41.72 36.07,44.66 v35.41,45.32
SCL  (via drill 0.39, 0.4, 0.48)
  Top 0.203: IC4.4 13.17,28.34 12.91,28.09 12.91,27.26 v12.83,27.18 | v16.38,32.38 16.51,32.51 18.05,32.51 18.7,31.86 IC3.19 | R5.2 6.39,35.14 v5.97,35.56 5.68,35.85 CONN1.4 | U3.28 33.71,42.84 v33.34,42.47 | X2.5 28,17.97 27.48,18.49 27.48,27.38 24.97,29.89 24.97,33.24 24.33,33.88 v23.4,33.88
  Bottom 0.203: v33.34,42.47 33.34,42.09 33.08,41.83 32.69,41.83 24.73,33.88 v23.4,33.88 | v16.38,32.38 16.26,32.26 16.26,30.61 v12.83,27.18 12.83,27.43 7.49,32.77 7.49,34.04 v5.97,35.56 5.97,38.23 6.35,38.61 7.62,38.61 11.9,34.33 14.98,34.33 15.16,34.51 16.65,34.51 17.93,33.24 22.89,33.24 23.4,33.75 v23.4,33.88 | v23.4,33.88
SD_PWR  (via drill 0.4)
  Top 0.203: v9.4,20.91 11.77,20.91 18.7,27.84 20.59,27.84 20.65,27.91 IC3.2 | 8.94,2.54 9.34,2.94 Q4.1 | v8.13,2.54 8.94,2.54 | R26.2 8.94,2.15 8.94,2.54
  Bottom 0.203: v9.4,20.91 9.4,3.3 8.64,2.54 v8.13,2.54
SD_VDD
  Top 0.254: X3.4 4.84,16.91 4.19,16.26 4.19,11.68 4.95,10.92 7.87,10.92 9.36,9.44 C37.1 9.89,7.58 9.84,7.52 C38.2 9.84,5.89 Q4.3
SDA  (via drill 0.39, 0.4, 0.48)
  Top 0.203: v14.75,26.44 14.91,26.6 14.4,27.11 IC4.6 | CONN1.3 6.53,38.87 7.18,38.23 v7.18,37.85 7.26,37.76 7.26,37.32 7.29,37.29 R7.2 | IC3.20 17.94,31.36 17.72,31.57 v17.72,31.75 | U3.29 34.56,42.5 34.48,42.42 v34.42,42.42 | X2.3 27,14.77 27.08,14.84 27.08,27.05 24.56,29.56 24.56,32.51 24.07,33 v24.07,33.14
  Bottom 0.203: v7.18,37.85 7.75,37.85 11.68,33.91 15.13,33.91 15.33,34.11 16.44,34.11 17.72,32.82 17.72,32.71 | v34.42,42.42 34.42,42.04 33.78,41.4 32.89,41.4 24.62,33.14 v24.07,33.14 24.05,33.14 23.62,32.71 17.72,32.71 | v14.75,26.44 14.75,27.58 17.31,30.14 17.33,31.36 v17.72,31.75 17.72,32.71
SPKR
  Top 0.203: U3.44 39.94,55.63 41.33,54.24 R19.2
SPKR_SD  (via drill 0.39, 0.4)
  Top 0.203: IC3.5 22.15,27.72 22.33,27.54 22.33,26.4 22.35,26.38 v22.57,26.38 22.57,26.29 23.44,25.42 R20.2 | v48.64,30.73 48.6,30.77 U6.1
  Bottom 0.203: v22.57,26.38 23.65,26.38 31.36,18.66 43.17,18.66 45.47,20.95 45.47,27.56 v48.64,30.73
TFT_CS
  Top 0.203: U3.35 36.77,47.98 38.57,46.18 39.29,46.18 39.7,45.76 39.7,45.11 41.12,43.69 41.12,42.65 40.82,42.34 39.97,42.34 39.82,42.49 TFT1.18
TFT_DC
  Top 0.203: U3.36 36.72,48.83 37.22,48.32 37.21,48.18 38.68,46.71 39.33,46.71 40.11,45.93 40.11,45.27 41.53,43.86 41.53,41.78 41.24,41.49 TFT1.16
TXD0
  Top 0.203: JP2.1 40.97,49.91 40.97,50.8 40.65,51.12 37.35,51.12 37.1,51.38 U3.39
UP  (via drill 0.39)
  Top 0.203: IC3.15 21.65,33.24 19.81,35.08 19.81,36.83 19.18,37.47 17.91,37.47 16.95,38.42 v16.95,38.8 16.95,36.62 R13.2
  Bottom 0.203: UP.2 17.02,44.32 17.02,38.86 v16.95,38.8
VBAT  (via drill 0.39, 0.4)
  Top 0.254: R10.1 18.64,20.55 v18.54,20.45
  Top 0.406: U2.3 57.26,29.83 57.02,29.59 57.02,27.56 60.62,23.96 X1.2
  Top 0.508: U2.3 59.34,31.01 C8.1 59.82,31.06 v59.82,32.38 | Q1.3 55.87,31.89 v55.88,31.88
  Bottom 0.254: v18.54,20.45 18.54,11.56 27.05,3.05 48.01,3.05 52.96,8 52.96,18.16 53.47,18.67 55.24,18.67 56.64,20.07 56.64,24.13 55.37,25.4 55.37,31.37 v55.88,31.88
  Bottom 0.508: v55.88,31.88 56.39,32.38 v59.82,32.38
VBUS  (via drill 0.39)
  Top 0.254: X4.B4A9 56.94,15.11 57.39,15.11 57.66,14.83 57.98,14.83 | X4.A4B9 56.94,10.19 57.39,10.19 57.8,10.6 58.48,10.6 | CHG1.A 62.13,24.83 60.79,26.16 v60.45,26.16
  Top 0.406: 57.98,14.83 59.08,14.83 | X4.B4A9 55.32,15.05 C1.1
  Top 0.508: 58.48,10.6 58.74,10.6 59.88,11.75 59.88,14.03 59.08,14.83 59.08,17.93 60.45,19.3 v61.59,19.3 | U2.4 55.99,29.83 v56.77,30.61 57.99,31.83 D4.A 58.12,31.92 R14.2 | R14.2 58.15,33.55 C15.1 | Q1.1 57.07,35.07 57.07,34.5 57.98,33.59 R14.2
  Bottom 0.508: v56.77,30.61 56.77,29.84 v60.45,26.16 61.59,25.02 v61.59,19.3
VCC
  Top 0.406: SJ2.2 10.53,41.95 9.93,42.54 C20.1 9.25,42.31 8.74,42.81 7.86,42.81 5.52,45.15 | SENSE2.2 7.35,49.53 5.08,49.53 4.32,48.77 4.32,46.35 5.52,45.15 | 5.52,45.15 4.45,44.07 4.45,32.51 3.3,31.37 3.3,30.1 4.28,29.12 SENSE1.2
VHIGH  (via drill 0.4, 0.5)
  Top 0.406: SJ2.1 13.85,43.34 13.85,44.46 v15.24,45.85 | U6.6 47.3,28.9 | 47.3,28.9 47.12,29.08 45.58,29.08 C3.1 | 47.3,28.9 47.86,29.46 50.55,29.46 52.45,31.37 v52.45,32.13
  Top 0.508: C12.1 58,36.7 C11.1 57.17,36.81 Q3.3 56.4,38.85 v56.2,39.05 55.94,39.05 54.7,40.29 IC2.4 | IC2.1 56.26,41.94 54.61,40.29 IC2.4 | IC2.4 50.04,44.61 v50.04,44.9 SJ1.3 | C31.1 14.19,45.7 C30.1 14.76,45.36 v15.24,45.85
  Bottom 0.406: v52.45,32.13 52.45,32.63 55.79,35.97 55.79,38.64 v56.2,39.05 | v15.24,45.85 16.64,45.85 17.88,47.09 24.16,47.09 27.56,43.69 30.73,43.69 33.02,45.98 33.02,47.5 34.67,49.15 39.24,49.15 42.04,46.35 48.58,46.35 v50.04,44.9
VPWR
  Top 0.508: U5.1 54.92,54.05 55.12,53.85 55.12,52.58 54.69,52.15 U5.3 | U5.3 C23.1 | U5.3 U1.1 55.04,50.49 55.12,50.42 55.12,48.64 55.07,48.59 U1.3 52.21,48.59 C19.1 52.2,48.07 51.24,47.12 51.24,46.67 SJ1.2
VSYNC
  Top 0.203: U3.9 22.25,49.68 19.28,46.71 19.28,41.92 23.81,37.38 23.81,35.92 25.78,33.95 25.78,30.23 28.3,27.71 28.3,18.83 29.01,18.12 X2.7

### Text on the board
214bmp: D:/SmartProjects/Snc/a4_bn_logo2.bmp